# Altium project 7z010.PrjPcb
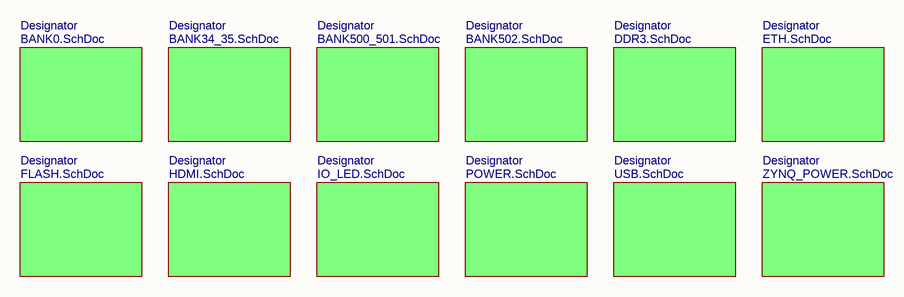
[diagram p0: TOP.SchDoc]
13 sheets, 293 parts. Net scope: global (net labels, ports and power ports of the same name join across sheets).
Board file: PCB1.PcbDoc
Sheets:
  TOP.SchDoc
    Designator = BANK0.SchDoc
    Designator = BANK34_35.SchDoc
    Designator = BANK500_501.SchDoc
    Designator = BANK502.SchDoc
    Designator = DDR3.SchDoc
    Designator = ETH.SchDoc
    Designator = FLASH.SchDoc
    Designator = HDMI.SchDoc
    Designator = IO_LED.SchDoc
    Designator = POWER.SchDoc
    Designator = USB.SchDoc
    Designator = ZYNQ_POWER.SchDoc

## Sheet TOP.SchDoc
size A4; SheetNumber: 1; SheetTotal: 13

### Sub-sheets
Designator = BANK0.SchDoc: no entries
Designator = BANK34_35.SchDoc: no entries
Designator = BANK500_501.SchDoc: no entries
Designator = BANK502.SchDoc: no entries
Designator = DDR3.SchDoc: no entries
Designator = ETH.SchDoc: no entries
Designator = FLASH.SchDoc: no entries
Designator = HDMI.SchDoc: no entries
Designator = IO_LED.SchDoc: no entries
Designator = POWER.SchDoc: no entries
Designator = USB.SchDoc: no entries
Designator = ZYNQ_POWER.SchDoc: no entries

## Sheet BANK0.SchDoc: BANK0
size A4; DrawnBy: nand; Revision: V0.1; SheetNumber: 3; SheetTotal: 13
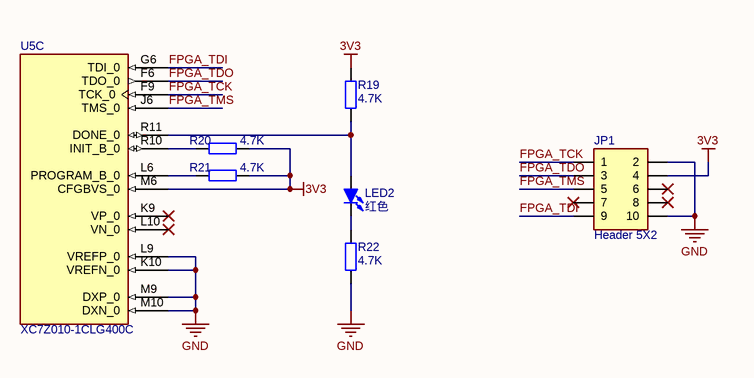
[diagram p1: BANK0.SchDoc]

### Parts
JP1  Header 5X2  [IDC2.54-LI-2x5P]
LED2  红色  [LED 0805G]
R19  4.7K  [R 0402_L]
R20  4.7K  [R 0402_L]
R21  4.7K  [R 0402_L]
R22  4.7K  [R 0402_L]
U5  XC7Z010-1CLG400C  [CLG400]  (part C of 9)

### Nets
3V3: JP1.4 R19.2 R20.1 R21.1 U5.M6(CFGBVS_0)
GND: JP1.2 JP1.10 R22.1 U5.K10(VREFN_0) U5.L9(VREFP_0) U5.M9(DXP_0) U5.M10(DXN_0)
FPGA_TCK: JP1.1 U5.F9(TCK_0)
FPGA_TDI: JP1.9 U5.G6(TDI_0)
FPGA_TDO: JP1.3 U5.F6(TDO_0)
FPGA_TMS: JP1.5 U5.J6(TMS_0)
NetLED2_1: LED2.1(A) R19.1 U5.R11(DONE_0)
NetLED2_2: LED2.2(K) R22.2
NetR20_2: R20.2 U5.R10(INIT_B_0)
NetR21_2: R21.2 U5.L6(PROGRAM_B_0)

Not connected (* = marked no-connect by the designer): JP1 6* 7* 8*; U5 K9(VP_0)* L10(VN_0)*

### Library data of the parts
JP1 = Header 5X2: 5*2P接插件; 版权归属: 源创客; BOM名称: 5*2P接插件; 学习资源: www.ooocke.com
LED2 = LED-SMD: 贴片LED; 版权归属: 源创客; BOM名称: 贴片LED; 学习资源: www.ooocke.com
R19-R22 = R: 贴片电阻; 版权归属: 源创客; BOM名称: 贴片电阻; 学习资源: www.ooocke.com
U5 = XC7Z010-1CLG400C: ZYNQ7000芯片

## Sheet BANK34_35.SchDoc
size A4; SheetNumber: 4; SheetTotal: 13
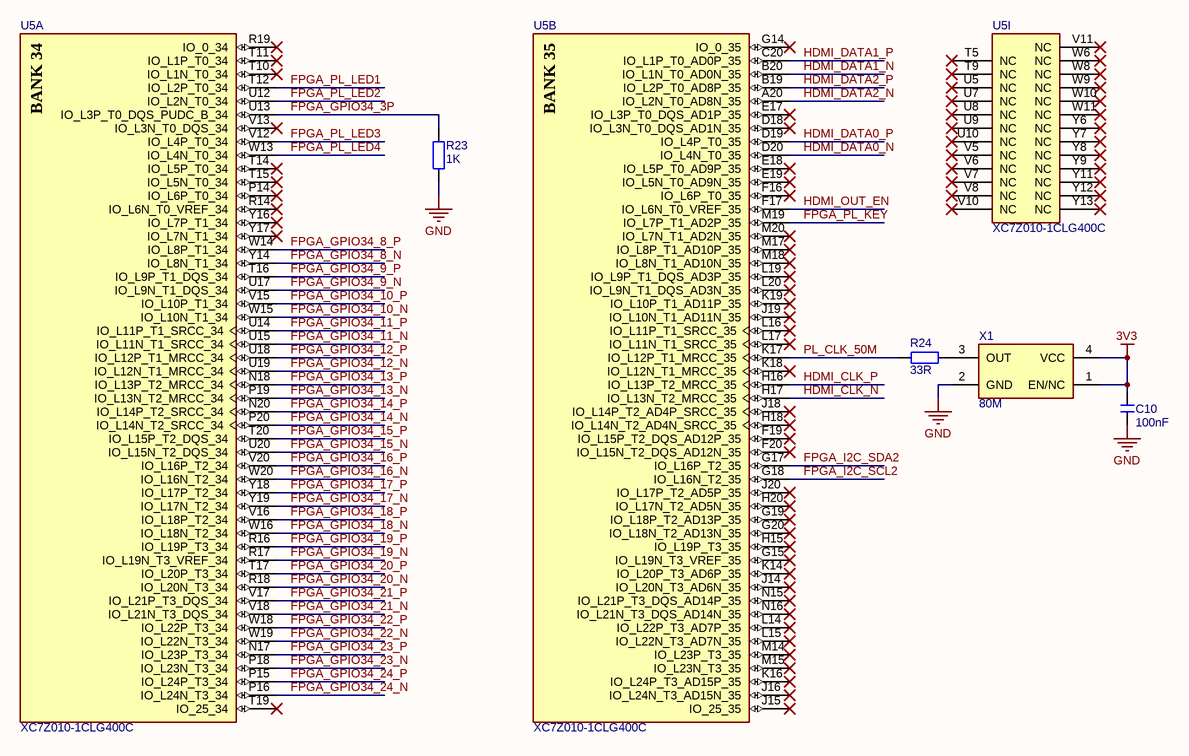
[diagram p2: BANK34_35.SchDoc]

### Parts
C10  100nF  [C 0402_L]
R23  1K  [R 0402_L]
R24  33R  [R 0805_L]
U5  XC7Z010-1CLG400C  [CLG400]  (parts A,B,I of 9)
X1  80M  [OSC 1612-4P]

### Nets
3V3: C10.2 X1.1(EN/NC) X1.4(VCC)
GND: C10.1 R23.2 X1.2(GND)
FPGA_GPIO34_3P: R23.1 U5.U13(IO_L3P_T0_DQS_PUDC_B_34)
FPGA_GPIO34_8_N: U5.Y14(IO_L8N_T1_34)
FPGA_GPIO34_8_P: U5.W14(IO_L8P_T1_34)
FPGA_GPIO34_9_N: U5.U17(IO_L9N_T1_DQS_34)
FPGA_GPIO34_9_P: U5.T16(IO_L9P_T1_DQS_34)
FPGA_GPIO34_10_N: U5.W15(IO_L10N_T1_34)
FPGA_GPIO34_10_P: U5.V15(IO_L10P_T1_34)
FPGA_GPIO34_11_N: U5.U15(IO_L11N_T1_SRCC_34)
FPGA_GPIO34_11_P: U5.U14(IO_L11P_T1_SRCC_34)
FPGA_GPIO34_12_N: U5.U19(IO_L12N_T1_MRCC_34)
FPGA_GPIO34_12_P: U5.U18(IO_L12P_T1_MRCC_34)
FPGA_GPIO34_13_N: U5.P19(IO_L13N_T2_MRCC_34)
FPGA_GPIO34_13_P: U5.N18(IO_L13P_T2_MRCC_34)
FPGA_GPIO34_14_N: U5.P20(IO_L14N_T2_SRCC_34)
FPGA_GPIO34_14_P: U5.N20(IO_L14P_T2_SRCC_34)
FPGA_GPIO34_15_N: U5.U20(IO_L15N_T2_DQS_34)
FPGA_GPIO34_15_P: U5.T20(IO_L15P_T2_DQS_34)
FPGA_GPIO34_16_N: U5.W20(IO_L16N_T2_34)
FPGA_GPIO34_16_P: U5.V20(IO_L16P_T2_34)
FPGA_GPIO34_17_N: U5.Y19(IO_L17N_T2_34)
FPGA_GPIO34_17_P: U5.Y18(IO_L17P_T2_34)
FPGA_GPIO34_18_N: U5.W16(IO_L18N_T2_34)
FPGA_GPIO34_18_P: U5.V16(IO_L18P_T2_34)
FPGA_GPIO34_19_N: U5.R17(IO_L19N_T3_VREF_34)
FPGA_GPIO34_19_P: U5.R16(IO_L19P_T3_34)
FPGA_GPIO34_20_N: U5.R18(IO_L20N_T3_34)
FPGA_GPIO34_20_P: U5.T17(IO_L20P_T3_34)
FPGA_GPIO34_21_N: U5.V18(IO_L21N_T3_DQS_34)
FPGA_GPIO34_21_P: U5.V17(IO_L21P_T3_DQS_34)
FPGA_GPIO34_22_N: U5.W19(IO_L22N_T3_34)
FPGA_GPIO34_22_P: U5.W18(IO_L22P_T3_34)
FPGA_GPIO34_23_N: U5.P18(IO_L23N_T3_34)
FPGA_GPIO34_23_P: U5.N17(IO_L23P_T3_34)
FPGA_GPIO34_24_N: U5.P16(IO_L24N_T3_34)
FPGA_GPIO34_24_P: U5.P15(IO_L24P_T3_34)
FPGA_I2C_SCL2: U5.G18(IO_L16N_T2_35)
FPGA_I2C_SDA2: U5.G17(IO_L16P_T2_35)
FPGA_PL_KEY: U5.M19(IO_L7P_T1_AD2P_35)
FPGA_PL_LED1: U5.T12(IO_L2P_T0_34)
FPGA_PL_LED2: U5.U12(IO_L2N_T0_34)
FPGA_PL_LED3: U5.V12(IO_L4P_T0_34)
FPGA_PL_LED4: U5.W13(IO_L4N_T0_34)
HDMI_CLK_N: U5.H17(IO_L13N_T2_MRCC_35)
HDMI_CLK_P: U5.H16(IO_L13P_T2_MRCC_35)
HDMI_DATA0_N: U5.D20(IO_L4N_T0_35)
HDMI_DATA0_P: U5.D19(IO_L4P_T0_35)
HDMI_DATA1_N: U5.B20(IO_L1N_T0_AD0N_35)
HDMI_DATA1_P: U5.C20(IO_L1P_T0_AD0P_35)
HDMI_DATA2_N: U5.A20(IO_L2N_T0_AD8N_35)
HDMI_DATA2_P: U5.B19(IO_L2P_T0_AD8P_35)
HDMI_OUT_EN: U5.F17(IO_L6N_T0_VREF_35)
PL_CLK_50M: R24.2 U5.K17(IO_L12P_T1_MRCC_35)
NetR24_1: R24.1 X1.3(OUT)

Not connected (* = marked no-connect by the designer): U5 D18(IO_L3N_T0_DQS_AD1N_35)* E17(IO_L3P_T0_DQS_AD1P_35)* E18(IO_L5P_T0_AD9P_35)* E19(IO_L5N_T0_AD9N_35)* F16(IO_L6P_T0_35)* F19(IO_L15P_T2_DQS_AD12P_35)* F20(IO_L15N_T2_DQS_AD12N_35)* G14(IO_0_35)* G15(IO_L19N_T3_VREF_35)* G19(IO_L18P_T2_AD13P_35)* G20(IO_L18N_T2_AD13N_35)* H15(IO_L19P_T3_35)* H18(IO_L14N_T2_AD4N_SRCC_35)* H20(IO_L17N_T2_AD5N_35)* J14(IO_L20N_T3_AD6N_35)* J15(IO_25_35)* J16(IO_L24N_T3_AD15N_35)* J18(IO_L14P_T2_AD4P_SRCC_35)* J19(IO_L10N_T1_AD11N_35)* J20(IO_L17P_T2_AD5P_35)* K14(IO_L20P_T3_AD6P_35)* K16(IO_L24P_T3_AD15P_35)* K18(IO_L12N_T1_MRCC_35)* K19(IO_L10P_T1_AD11P_35)* L14(IO_L22P_T3_AD7P_35)* L15(IO_L22N_T3_AD7N_35)* L16(IO_L11P_T1_SRCC_35)* L17(IO_L11N_T1_SRCC_35)* L19(IO_L9P_T1_DQS_AD3P_35)* L20(IO_L9N_T1_DQS_AD3N_35)* M14(IO_L23P_T3_35)* M15(IO_L23N_T3_35)* M17(IO_L8P_T1_AD10P_35)* M18(IO_L8N_T1_AD10N_35)* M20(IO_L7N_T1_AD2N_35)* N15(IO_L21P_T3_DQS_AD14P_35)* N16(IO_L21N_T3_DQS_AD14N_35)* P14(IO_L6P_T0_34)* R14(IO_L6N_T0_VREF_34)* R19(IO_0_34)* T5(NC)* T9(NC)* T10(IO_L1N_T0_34)* T11(IO_L1P_T0_34)* T14(IO_L5P_T0_34)* T15(IO_L5N_T0_34)* T19(IO_25_34)* U5(NC)* U7(NC)* U8(NC)* U9(NC)* U10(NC)* V5(NC)* V6(NC)* V7(NC)* V8(NC)* V10(NC)* V11(NC)* V13(IO_L3N_T0_DQS_34)* W6(NC)* W8(NC)* W9(NC)* W10(NC)* W11(NC)* Y6(NC)* Y7(NC)* Y8(NC)* Y9(NC)* Y11(NC)* Y12(NC)* Y13(NC)* Y16(IO_L7P_T1_34)* Y17(IO_L7N_T1_34)*

### Notes on the sheet
- (in symbol XC7Z010-1CLG400C, part A) BANK 34
- (in symbol XC7Z010-1CLG400C, part B) BANK 35

### Library data of the parts
C10 = C: 无极性贴片电容; 版权归属: 源创客; BOM名称: 无极性贴片电容; 学习资源: www.ooocke.com
R23 R24 = R: 贴片电阻; 版权归属: 源创客; BOM名称: 贴片电阻; 学习资源: www.ooocke.com
U5 = XC7Z010-1CLG400C: ZYNQ7000芯片
X1 = XTAL-ACT-4P: 4脚有源晶振; 版权归属: 源创客; BOM名称: 4脚有源晶振; 学习资源: www.ooocke.com

## Sheet BANK500_501.SchDoc
size A4; SheetNumber: 5; SheetTotal: 13
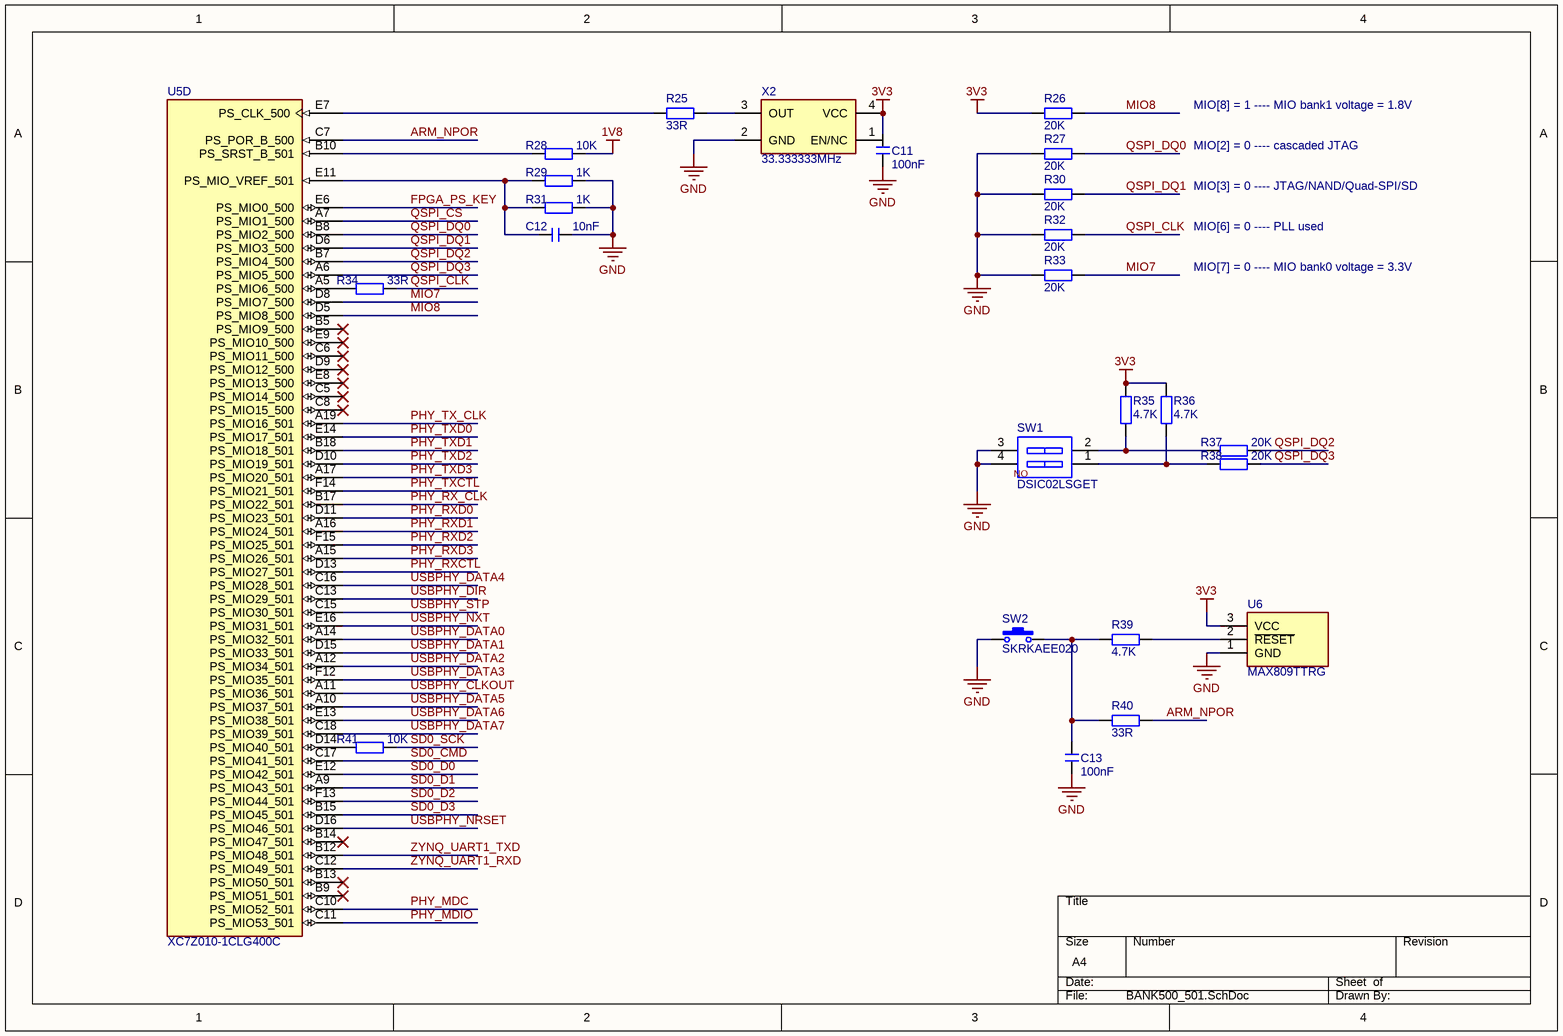
[diagram p3: BANK500_501.SchDoc]

### Parts
C11  100nF  [C 0402_L]
C12  10nF  [C 0402_L]
C13  100nF  [C 0402_L]
R25  33R  [R 0805_L]
R26  20K  [R 0805_L]
R27  20K  [R 0805_L]
R28  10K  [R 0402_L]
R29  1K  [R 0402_L]
R30  20K  [R 0805_L]
R31  1K  [R 0402_L]
R32  20K  [R 0805_L]
R33  20K  [R 0805_L]
R34  33R  [R 0805_L]
R35  4.7K  [R 0402_L]
R36  4.7K  [R 0402_L]
R37  20K  [R 0805_L]
R38  20K  [R 0805_L]
R39  4.7K  [R 0402_L]
R40  33R  [R 0805_L]
R41  10K  [R 0402_L]
SW1  DSIC02LSGET  [SOP254P930X445-4N]
SW2  SKRKAEE020  [SKRKAEE020]
U5  XC7Z010-1CLG400C  [CLG400]  (part D of 9)
U6  MAX809TTRG  [SOT23-3L]
X2  33.333333MHz  [OSC 1612-4P]

### Nets
1V8: R28.1
3V3: C11.2 R26.2 R35.1 R36.1 U6.3(VCC) X2.4(VCC)
GND: C11.1 C12.1 C13.1 R27.2 R29.1 R30.2 R31.1 R32.2 R33.2 SW1.3 SW1.4 SW2.1 U6.1(GND) X2.2(GND)
ARM_NPOR: R40.1 U5.C7(PS_POR_B_500)
FPGA_PS_KEY: U5.E6(PS_MIO0_500)
MIO7: R33.1 U5.D8(PS_MIO7_500)
MIO8: R26.1 U5.D5(PS_MIO8_500)
PHY_MDC: U5.C10(PS_MIO52_501)
PHY_MDIO: U5.C11(PS_MIO53_501)
PHY_RX_CLK: U5.B17(PS_MIO22_501)
PHY_RXCTL: U5.D13(PS_MIO27_501)
PHY_RXD0: U5.D11(PS_MIO23_501)
PHY_RXD1: U5.A16(PS_MIO24_501)
PHY_RXD2: U5.F15(PS_MIO25_501)
PHY_RXD3: U5.A15(PS_MIO26_501)
PHY_TX_CLK: U5.A19(PS_MIO16_501)
PHY_TXCTL: U5.F14(PS_MIO21_501)
PHY_TXD0: U5.E14(PS_MIO17_501)
PHY_TXD1: U5.B18(PS_MIO18_501)
PHY_TXD2: U5.D10(PS_MIO19_501)
PHY_TXD3: U5.A17(PS_MIO20_501)
QSPI_CLK: R32.1 R34.1
QSPI_CS: U5.A7(PS_MIO1_500)
QSPI_DQ0: R27.1 U5.B8(PS_MIO2_500)
QSPI_DQ1: R30.1 U5.D6(PS_MIO3_500)
QSPI_DQ2: R37.1 U5.B7(PS_MIO4_500)
QSPI_DQ3: R38.1 U5.A6(PS_MIO5_500)
SD0_CMD: U5.C17(PS_MIO41_501)
SD0_D0: U5.E12(PS_MIO42_501)
SD0_D1: U5.A9(PS_MIO43_501)
SD0_D2: U5.F13(PS_MIO44_501)
SD0_D3: U5.B15(PS_MIO45_501)
SD0_SCK: R41.1
USBPHY_CLKOUT: U5.A11(PS_MIO36_501)
USBPHY_DATA0: U5.A14(PS_MIO32_501)
USBPHY_DATA1: U5.D15(PS_MIO33_501)
USBPHY_DATA2: U5.A12(PS_MIO34_501)
USBPHY_DATA3: U5.F12(PS_MIO35_501)
USBPHY_DATA4: U5.C16(PS_MIO28_501)
USBPHY_DATA5: U5.A10(PS_MIO37_501)
USBPHY_DATA6: U5.E13(PS_MIO38_501)
USBPHY_DATA7: U5.C18(PS_MIO39_501)
USBPHY_DIR: U5.C13(PS_MIO29_501)
USBPHY_NRSET: U5.D16(PS_MIO46_501)
USBPHY_NXT: U5.E16(PS_MIO31_501)
USBPHY_STP: U5.C15(PS_MIO30_501)
ZYNQ_UART1_RXD: U5.C12(PS_MIO49_501)
ZYNQ_UART1_TXD: U5.B12(PS_MIO48_501)
NetC12_2: C12.2 R29.2 R31.2 U5.E11(PS_MIO_VREF_501)
NetC13_2: C13.2 R39.2 R40.2 SW2.2
NetR25_1: R25.1 X2.3(OUT)
NetR25_2: R25.2 U5.E7(PS_CLK_500)
NetR28_2: R28.2 U5.B10(PS_SRST_B_501)
NetR34_2: R34.2 U5.A5(PS_MIO6_500)
NetR35_2: R35.2 R37.2 SW1.2
NetR36_2: R36.2 R38.2 SW1.1
NetR39_1: R39.1 U6.2(~{RESET})
NetR41_2: R41.2 U5.D14(PS_MIO40_501)

Not connected (* = marked no-connect by the designer): U5 B5(PS_MIO9_500)* B9(PS_MIO51_501)* B13(PS_MIO50_501)* B14(PS_MIO47_501)* C5(PS_MIO14_500)* C6(PS_MIO11_500)* C8(PS_MIO15_500)* D9(PS_MIO12_500)* E8(PS_MIO13_500)* E9(PS_MIO10_500)*; X2 1(EN/NC)

### Notes on the sheet
- MIO[8] = 1 ---- MIO bank1 voltage = 1.8V
- MIO[2] = 0 ---- cascaded JTAG
- MIO[3] = 0 ---- JTAG/NAND/Quad-SPI/SD
- MIO[6] = 0 ---- PLL used
- MIO[7] = 0 ---- MIO bank0 voltage = 3.3V
- (in symbol DSIC02LSGET) ON

### Library data of the parts
C11-C13 = C: 无极性贴片电容; 版权归属: 源创客; BOM名称: 无极性贴片电容; 学习资源: www.ooocke.com
R25-R41 = R: 贴片电阻; 版权归属: 源创客; BOM名称: 贴片电阻; 学习资源: www.ooocke.com
SW1 = DSIC02LSGET: 2路拨动开关; Manufacturer_Name: Dongguan Guangzhu Industrial; Datasheet Link: https://datasheet.lcsc.com/szlcsc/Dongguan-Guangzhu-Industrial-DSIC02LSGET_C54949.pdf; Height: 4.45mm; Manufacturer_Part_Number: DSIC02LSGET
SW2 = SKRKAEE020: 2.9x3.9轻触开关; BOM名称: 3x6轻触开关; 联系卖家，免费查找封装: 唯一出售店铺网址https://shop463601444.taobao.com; 封装库来自淘宝卖家ID：黄晶宝石: 其他店铺购入的，请立即申请退款，本店现金奖励20~500元
U5 = XC7Z010-1CLG400C: ZYNQ7000芯片
U6 = MAX809TTRG: 电压检测复位芯片; Manufacturer_Name: onsemi; Datasheet Link: http://www.onsemi.com/pub/Collateral/MAX809S-D.PDF; Height: 1.11mm; Manufacturer_Part_Number: MAX809TTRG; Mouser Part Number: 863-MAX809TTRG; Mouser Price/Stock: https://www.mouser.com/Search/Refine.aspx?Keyword=863-MAX809TTRG; Arrow Part Number: MAX809TTRG; Arrow Price/Stock: https://www.arrow.com/en/products/max809ttrg/on-semiconductor
X2 = XTAL-ACT-4P: 4脚有源晶振; 版权归属: 源创客; BOM名称: 4脚有源晶振; 学习资源: www.ooocke.com

## Sheet BANK502.SchDoc
size A4; SheetNumber: 6; SheetTotal: 13
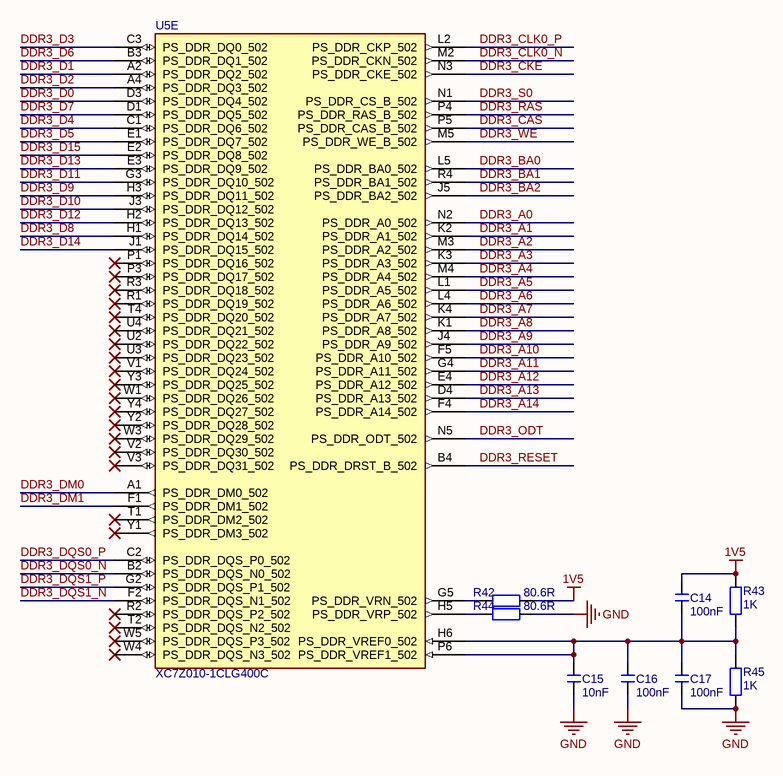
[diagram p4: BANK502.SchDoc]

### Parts
C14  100nF  [C 0402_L]
C15  10nF  [C 0402_L]
C16  100nF  [C 0402_L]
C17  100nF  [C 0402_L]
R42  80.6R  [R 0805_L]
R43  1K  [R 0402_L]
R44  80.6R  [R 0805_L]
R45  1K  [R 0402_L]
U5  XC7Z010-1CLG400C  [CLG400]  (part E of 9)

### Nets
1V5: C14.2 R42.2 R43.1
GND: C15.1 C16.1 C17.1 R44.2 R45.2
DDR3_A0: U5.N2(PS_DDR_A0_502)
DDR3_A1: U5.K2(PS_DDR_A1_502)
DDR3_A2: U5.M3(PS_DDR_A2_502)
DDR3_A3: U5.K3(PS_DDR_A3_502)
DDR3_A4: U5.M4(PS_DDR_A4_502)
DDR3_A5: U5.L1(PS_DDR_A5_502)
DDR3_A6: U5.L4(PS_DDR_A6_502)
DDR3_A7: U5.K4(PS_DDR_A7_502)
DDR3_A8: U5.K1(PS_DDR_A8_502)
DDR3_A9: U5.J4(PS_DDR_A9_502)
DDR3_A10: U5.F5(PS_DDR_A10_502)
DDR3_A11: U5.G4(PS_DDR_A11_502)
DDR3_A12: U5.E4(PS_DDR_A12_502)
DDR3_A13: U5.D4(PS_DDR_A13_502)
DDR3_A14: U5.F4(PS_DDR_A14_502)
DDR3_BA0: U5.L5(PS_DDR_BA0_502)
DDR3_BA1: U5.R4(PS_DDR_BA1_502)
DDR3_BA2: U5.J5(PS_DDR_BA2_502)
DDR3_CAS: U5.P5(PS_DDR_CAS_B_502)
DDR3_CKE: U5.N3(PS_DDR_CKE_502)
DDR3_CLK0_N: U5.M2(PS_DDR_CKN_502)
DDR3_CLK0_P: U5.L2(PS_DDR_CKP_502)
DDR3_D0: U5.D3(PS_DDR_DQ4_502)
DDR3_D1: U5.A2(PS_DDR_DQ2_502)
DDR3_D2: U5.A4(PS_DDR_DQ3_502)
DDR3_D3: U5.C3(PS_DDR_DQ0_502)
DDR3_D4: U5.C1(PS_DDR_DQ6_502)
DDR3_D5: U5.E1(PS_DDR_DQ7_502)
DDR3_D6: U5.B3(PS_DDR_DQ1_502)
DDR3_D7: U5.D1(PS_DDR_DQ5_502)
DDR3_D8: U5.H1(PS_DDR_DQ14_502)
DDR3_D9: U5.H3(PS_DDR_DQ11_502)
DDR3_D10: U5.J3(PS_DDR_DQ12_502)
DDR3_D11: U5.G3(PS_DDR_DQ10_502)
DDR3_D12: U5.H2(PS_DDR_DQ13_502)
DDR3_D13: U5.E3(PS_DDR_DQ9_502)
DDR3_D14: U5.J1(PS_DDR_DQ15_502)
DDR3_D15: U5.E2(PS_DDR_DQ8_502)
DDR3_DM0: U5.A1(PS_DDR_DM0_502)
DDR3_DM1: U5.F1(PS_DDR_DM1_502)
DDR3_DQS0_N: U5.B2(PS_DDR_DQS_N0_502)
DDR3_DQS0_P: U5.C2(PS_DDR_DQS_P0_502)
DDR3_DQS1_N: U5.F2(PS_DDR_DQS_N1_502)
DDR3_DQS1_P: U5.G2(PS_DDR_DQS_P1_502)
DDR3_ODT: U5.N5(PS_DDR_ODT_502)
DDR3_RAS: U5.P4(PS_DDR_RAS_B_502)
DDR3_RESET: U5.B4(PS_DDR_DRST_B_502)
DDR3_S0: U5.N1(PS_DDR_CS_B_502)
DDR3_WE: U5.M5(PS_DDR_WE_B_502)
NetC14_1: C14.1 C15.2 C16.2 C17.2 R43.2 R45.1 U5.H6(PS_DDR_VREF0_502) U5.P6(PS_DDR_VREF1_502)
NetR42_1: R42.1 U5.G5(PS_DDR_VRN_502)
NetR44_1: R44.1 U5.H5(PS_DDR_VRP_502)

Not connected (* = marked no-connect by the designer): U5 P1(PS_DDR_DQ16_502)* P3(PS_DDR_DQ17_502)* R1(PS_DDR_DQ19_502)* R2(PS_DDR_DQS_P2_502)* R3(PS_DDR_DQ18_502)* T1(PS_DDR_DM2_502)* T2(PS_DDR_DQS_N2_502)* T4(PS_DDR_DQ20_502)* U2(PS_DDR_DQ22_502)* U3(PS_DDR_DQ23_502)* U4(PS_DDR_DQ21_502)* V1(PS_DDR_DQ24_502)* V2(PS_DDR_DQ30_502)* V3(PS_DDR_DQ31_502)* W1(PS_DDR_DQ26_502)* W3(PS_DDR_DQ29_502)* W4(PS_DDR_DQS_N3_502)* W5(PS_DDR_DQS_P3_502)* Y1(PS_DDR_DM3_502)* Y2(PS_DDR_DQ28_502)* Y3(PS_DDR_DQ25_502)* Y4(PS_DDR_DQ27_502)*

### Library data of the parts
C14-C17 = C: 无极性贴片电容; 版权归属: 源创客; BOM名称: 无极性贴片电容; 学习资源: www.ooocke.com
R42-R45 = R: 贴片电阻; 版权归属: 源创客; BOM名称: 贴片电阻; 学习资源: www.ooocke.com
U5 = XC7Z010-1CLG400C: ZYNQ7000芯片

## Sheet DDR3.SchDoc
size A4; SheetNumber: 8; SheetTotal: 13
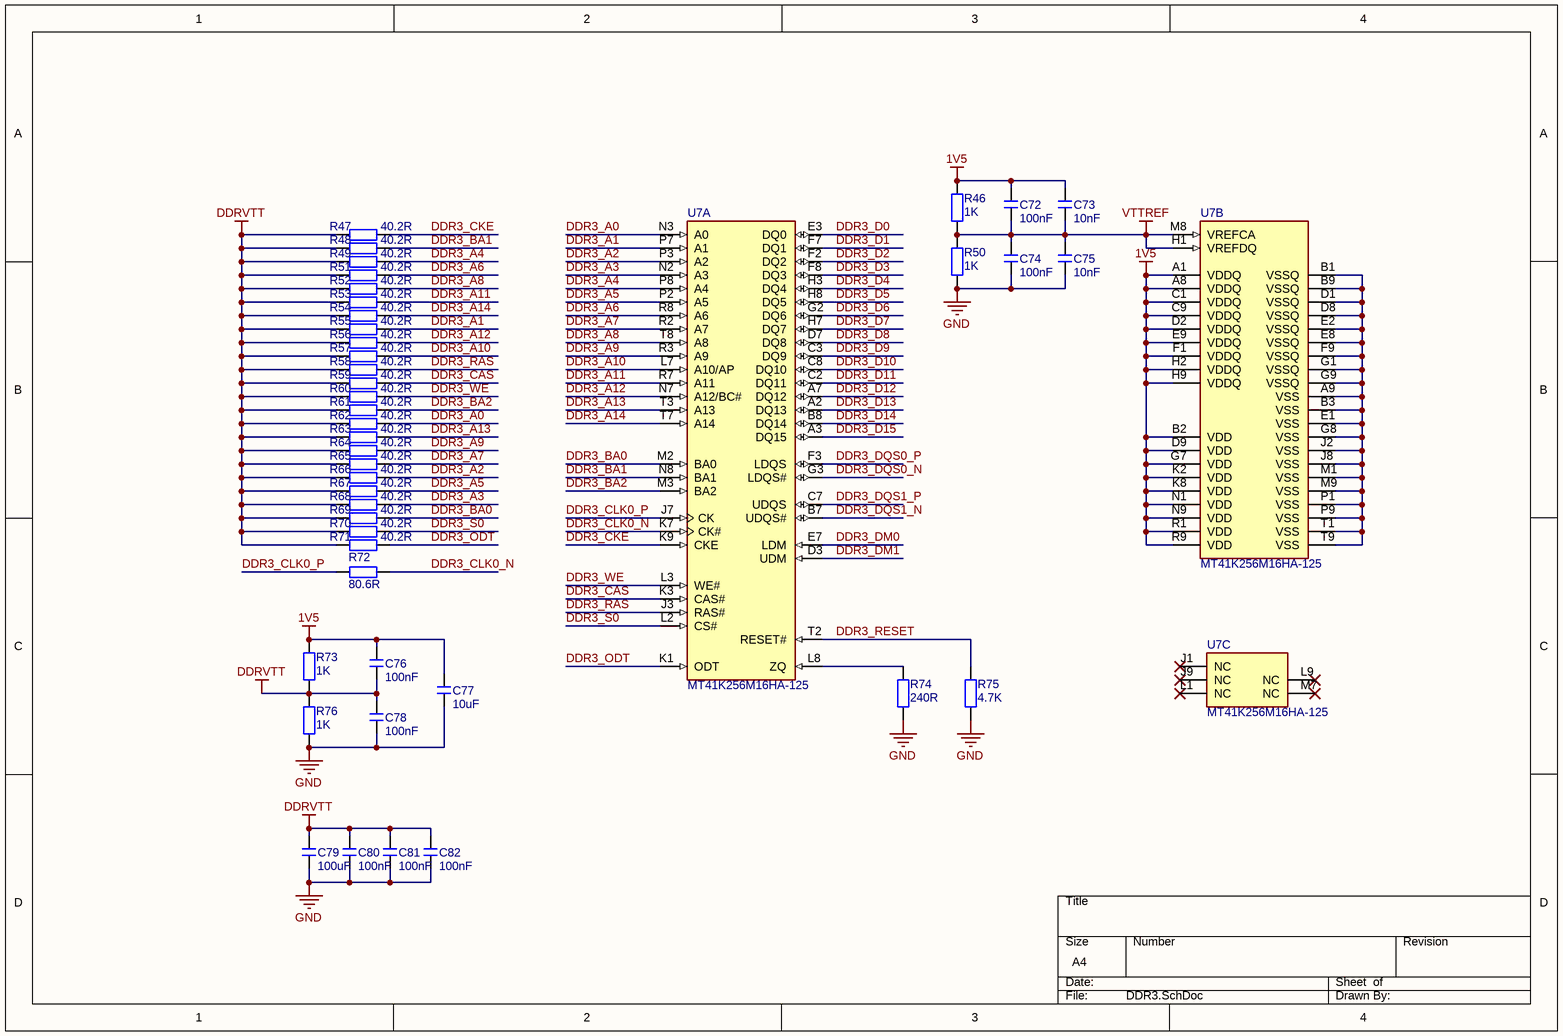
[diagram p5: DDR3.SchDoc]

### Parts
C72  100nF  [C 0402_L]
C73  10nF  [C 0402_L]
C74  100nF  [C 0402_L]
C75  10nF  [C 0402_L]
C76  100nF  [C 0402_L]
C77  10uF  [C 0603_L]
C78  100nF  [C 0402_L]
C79  100uF  [C 0805_L]
C80  100nF  [C 0402_L]
C81  100nF  [C 0402_L]
C82  100nF  [C 0402_L]
R46  1K  [R 0402_L]
R47  40.2R  [R 0805_L]
R48  40.2R  [R 0805_L]
R49  40.2R  [R 0805_L]
R50  1K  [R 0402_L]
R51  40.2R  [R 0805_L]
R52  40.2R  [R 0805_L]
R53  40.2R  [R 0805_L]
R54  40.2R  [R 0805_L]
R55  40.2R  [R 0805_L]
R56  40.2R  [R 0805_L]
R57  40.2R  [R 0805_L]
R58  40.2R  [R 0805_L]
R59  40.2R  [R 0805_L]
R60  40.2R  [R 0805_L]
R61  40.2R  [R 0805_L]
R62  40.2R  [R 0805_L]
R63  40.2R  [R 0805_L]
R64  40.2R  [R 0805_L]
R65  40.2R  [R 0805_L]
R66  40.2R  [R 0805_L]
R67  40.2R  [R 0805_L]
R68  40.2R  [R 0805_L]
R69  40.2R  [R 0805_L]
R70  40.2R  [R 0805_L]
R71  40.2R  [R 0805_L]
R72  80.6R  [R 0805_L]
R73  1K  [R 0402_L]
R74  240R  [R 0805_L]
R75  4.7K  [R 0402_L]
R76  1K  [R 0402_L]
U7  MT41K256M16HA-125  [BGA96C80P9X16_800X1300X120]  (parts A,B,C of 3)

### Nets
1V5: C72.2 C73.2 C76.2 C77.2 R46.2 R73.1 U7.A1(VDDQ) U7.A8(VDDQ) U7.B2(VDD) U7.C1(VDDQ) U7.C9(VDDQ) U7.D2(VDDQ) U7.D9(VDD) U7.E9(VDDQ) U7.F1(VDDQ) U7.G7(VDD) U7.H2(VDDQ) U7.H9(VDDQ) U7.K2(VDD) U7.K8(VDD) U7.N1(VDD) U7.N9(VDD) U7.R1(VDD) U7.R9(VDD)
DDRVTT: C76.1 C78.2 C79.2 C80.2 C81.2 C82.2 R47.2 R48.2 R49.2 R51.2 R52.2 R53.2 R54.2 R55.2 R56.2 R57.2 R58.2 R59.2 R60.2 R61.2 R62.2 R63.2 R64.2 R65.2 R66.2 R67.2 R68.2 R69.2 R70.2 R71.2 R73.2 R76.1
GND: C74.1 C75.1 C77.1 C78.1 C79.1 C80.1 C81.1 C82.1 R50.1 R74.2 R75.2 R76.2
VTTREF: C72.1 C73.1 C74.2 C75.2 R46.1 R50.2 U7.H1(VREFDQ) U7.M8(VREFCA)
DDR3_A0: R62.1 U7.N3(A0)
DDR3_A1: R55.1 U7.P7(A1)
DDR3_A2: R66.1 U7.P3(A2)
DDR3_A3: R68.1 U7.N2(A3)
DDR3_A4: R49.1 U7.P8(A4)
DDR3_A5: R67.1 U7.P2(A5)
DDR3_A6: R51.1 U7.R8(A6)
DDR3_A7: R65.1 U7.R2(A7)
DDR3_A8: R52.1 U7.T8(A8)
DDR3_A9: R64.1 U7.R3(A9)
DDR3_A10: R57.1 U7.L7(A10/AP)
DDR3_A11: R53.1 U7.R7(A11)
DDR3_A12: R56.1 U7.N7(A12/BC#)
DDR3_A13: R63.1 U7.T3(A13)
DDR3_A14: R54.1 U7.T7(A14)
DDR3_BA0: R69.1 U7.M2(BA0)
DDR3_BA1: R48.1 U7.N8(BA1)
DDR3_BA2: R61.1 U7.M3(BA2)
DDR3_CAS: R59.1 U7.K3(CAS#)
DDR3_CKE: R47.1 U7.K9(CKE)
DDR3_CLK0_N: R72.2 U7.K7(CK#)
DDR3_CLK0_P: R72.1 U7.J7(CK)
DDR3_D0: U7.E3(DQ0)
DDR3_D1: U7.F7(DQ1)
DDR3_D2: U7.F2(DQ2)
DDR3_D3: U7.F8(DQ3)
DDR3_D4: U7.H3(DQ4)
DDR3_D5: U7.H8(DQ5)
DDR3_D6: U7.G2(DQ6)
DDR3_D7: U7.H7(DQ7)
DDR3_D8: U7.D7(DQ8)
DDR3_D9: U7.C3(DQ9)
DDR3_D10: U7.C8(DQ10)
DDR3_D11: U7.C2(DQ11)
DDR3_D12: U7.A7(DQ12)
DDR3_D13: U7.A2(DQ13)
DDR3_D14: U7.B8(DQ14)
DDR3_D15: U7.A3(DQ15)
DDR3_DM0: U7.E7(LDM)
DDR3_DM1: U7.D3(UDM)
DDR3_DQS0_N: U7.G3(LDQS#)
DDR3_DQS0_P: U7.F3(LDQS)
DDR3_DQS1_N: U7.B7(UDQS#)
DDR3_DQS1_P: U7.C7(UDQS)
DDR3_ODT: R71.1 U7.K1(ODT)
DDR3_RAS: R58.1 U7.J3(RAS#)
DDR3_RESET: R75.1 U7.T2(RESET#)
DDR3_S0: R70.1 U7.L2(CS#)
DDR3_WE: R60.1 U7.L3(WE#)
NetR74_1: R74.1 U7.L8(ZQ)
NetU7_A9: U7.A9(VSS) U7.B1(VSSQ) U7.B3(VSS) U7.B9(VSSQ) U7.D1(VSSQ) U7.D8(VSSQ) U7.E1(VSS) U7.E2(VSSQ) U7.E8(VSSQ) U7.F9(VSSQ) U7.G1(VSSQ) U7.G8(VSS) U7.G9(VSSQ) U7.J2(VSS) U7.J8(VSS) U7.M1(VSS) U7.M9(VSS) U7.P1(VSS) U7.P9(VSS) U7.T1(VSS) U7.T9(VSS)

Not connected (* = marked no-connect by the designer): U7 J1(NC)* J9(NC)* L1(NC)* L9(NC)* M7(NC)*

### Library data of the parts
C72-C82 = C: 无极性贴片电容; 版权归属: 源创客; BOM名称: 无极性贴片电容; 学习资源: www.ooocke.com
R46-R76 = R: 贴片电阻; 版权归属: 源创客; BOM名称: 贴片电阻; 学习资源: www.ooocke.com
U7 = MT41K256M16HA-125: DDR3-16位数据-14位地址

## Sheet ETH.SchDoc
size A4; SheetNumber: 9; SheetTotal: 12
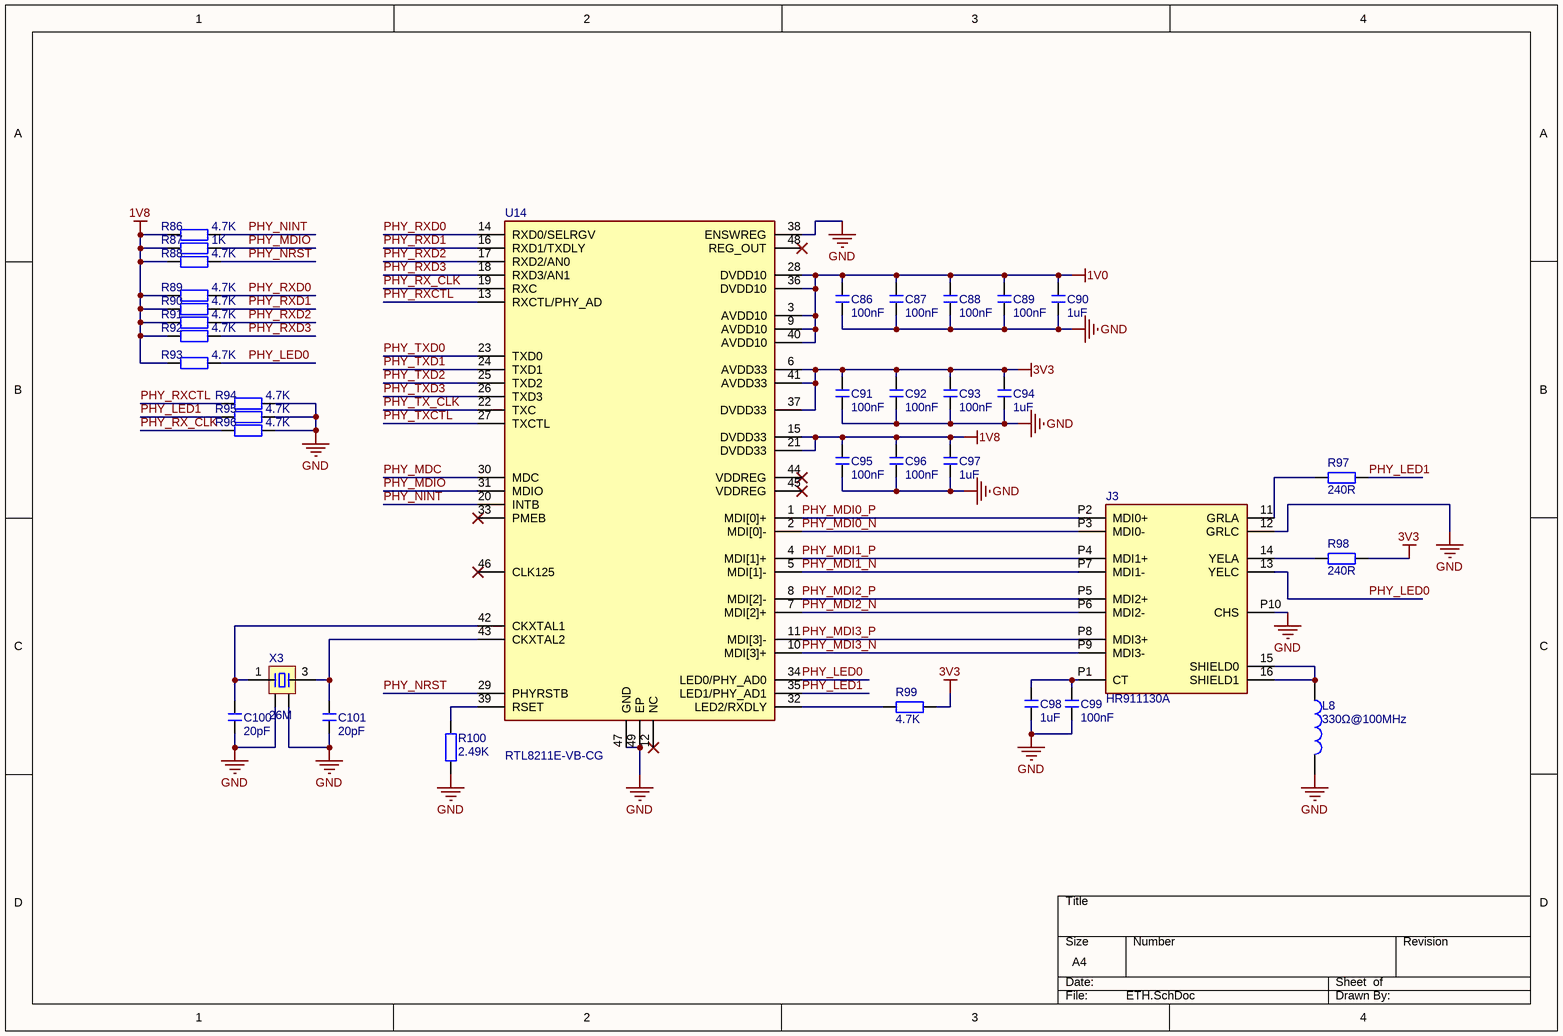
[diagram p6: ETH.SchDoc]

### Parts
C86  100nF  [C 0402_L]
C87  100nF  [C 0402_L]
C88  100nF  [C 0402_L]
C89  100nF  [C 0402_L]
C90  1uF  [C 0402_L]
C91  100nF  [C 0402_L]
C92  100nF  [C 0402_L]
C93  100nF  [C 0402_L]
C94  1uF  [C 0402_L]
C95  100nF  [C 0402_L]
C96  100nF  [C 0402_L]
C97  1uF  [C 0402_L]
C98  1uF  [C 0402_L]
C99  100nF  [C 0402_L]
C100  20pF  [C 0805_L]
C101  20pF  [C 0805_L]
J3  HR911130A  [HR911130A]
L8  330Ω@100MHz  [L 0805]
R86  4.7K  [R 0402_L]
R87  1K  [R 0402_L]
R88  4.7K  [R 0402_L]
R89  4.7K  [R 0402_L]
R90  4.7K  [R 0402_L]
R91  4.7K  [R 0402_L]
R92  4.7K  [R 0402_L]
R93  4.7K  [R 0402_L]
R94  4.7K  [R 0402_L]
R95  4.7K  [R 0402_L]
R96  4.7K  [R 0402_L]
R97  240R  [R 0805_L]
R98  240R  [R 0805_L]
R99  4.7K  [R 0402_L]
R100  2.49K  [R 0402_L]
U14  RTL8211E-VB-CG  [QFN48 7X7_L]
X3  26M  [OSC 1612-4P]

### Nets
1V0: C86.2 C87.2 C88.2 C89.2 C90.2 U14.3(AVDD10) U14.9(AVDD10) U14.28(DVDD10) U14.36(DVDD10) U14.40(AVDD10)
1V8: C95.2 C96.2 C97.2 R86.2 R87.2 R88.2 R89.2 R90.2 R91.2 R92.2 R93.2 U14.15(DVDD33) U14.21(DVDD33)
3V3: C91.2 C92.2 C93.2 C94.2 R98.1 R99.1 U14.6(AVDD33) U14.37(DVDD33) U14.41(AVDD33)
GND: C86.1 C87.1 C88.1 C89.1 C90.1 C91.1 C92.1 C93.1 C94.1 C95.1 C96.1 C97.1 C98.1 C99.1 C100.1 C101.1 J3.12(GRLC) J3.P10(CHS) L8.2 R94.1 R95.1 R96.1 R100.1 U14.38(ENSWREG) U14.47(GND) U14.49(EP) X3.2 X3.4
PHY_LED0: J3.13(YELC) R93.1 U14.34(LED0/PHY_AD0)
PHY_LED1: R95.2 R97.1 U14.35(LED1/PHY_AD1)
PHY_MDC: U14.30(MDC)
PHY_MDI0_N: J3.P3(MDI0-) U14.2(MDI[0]-)
PHY_MDI0_P: J3.P2(MDI0+) U14.1(MDI[0]+)
PHY_MDI1_N: J3.P7(MDI1-) U14.5(MDI[1]-)
PHY_MDI1_P: J3.P4(MDI1+) U14.4(MDI[1]+)
PHY_MDI2_N: J3.P6(MDI2-) U14.7(MDI[2]+)
PHY_MDI2_P: J3.P5(MDI2+) U14.8(MDI[2]-)
PHY_MDI3_N: J3.P9(MDI3-) U14.10(MDI[3]+)
PHY_MDI3_P: J3.P8(MDI3+) U14.11(MDI[3]-)
PHY_MDIO: R87.1 U14.31(MDIO)
PHY_NINT: R86.1 U14.20(INTB)
PHY_NRST: R88.1 U14.29(PHYRSTB)
PHY_RX_CLK: R96.2 U14.19(RXC)
PHY_RXCTL: R94.2 U14.13(RXCTL/PHY_AD)
PHY_RXD0: R89.1 U14.14(RXD0/SELRGV)
PHY_RXD1: R90.1 U14.16(RXD1/TXDLY)
PHY_RXD2: R91.1 U14.17(RXD2/AN0)
PHY_RXD3: R92.1 U14.18(RXD3/AN1)
PHY_TX_CLK: U14.22(TXC)
PHY_TXCTL: U14.27(TXCTL)
PHY_TXD0: U14.23(TXD0)
PHY_TXD1: U14.24(TXD1)
PHY_TXD2: U14.25(TXD2)
PHY_TXD3: U14.26(TXD3)
NetC98_2: C98.2 C99.2 J3.P1(CT)
NetC100_2: C100.2 U14.42(CKXTAL1) X3.1
NetC101_2: C101.2 U14.43(CKXTAL2) X3.3
NetJ3_11: J3.11(GRLA) R97.2
NetJ3_14: J3.14(YELA) R98.2
NetJ3_15: J3.15(SHIELD0) J3.16(SHIELD1) L8.1
NetR99_2: R99.2 U14.32(LED2/RXDLY)
NetR100_2: R100.2 U14.39(RSET)

Not connected (* = marked no-connect by the designer): U14 12(NC)* 33(PMEB)* 44(VDDREG)* 45(VDDREG)* 46(CLK125)* 48(REG_OUT)*

### Library data of the parts
C86-C101 = C: 无极性贴片电容; 版权归属: 源创客; BOM名称: 无极性贴片电容; 学习资源: www.ooocke.com
J3 = HR911130A: 千兆以太网带变压器; Manufacturer_Name: Hanrun Electronics; Datasheet Link: https://datasheet.lcsc.com/szlcsc/Zhongshan-HanRun-Elec-HR911130A_C54408.pdf; Height: 13mm; Manufacturer_Part_Number: HR911130A
L8 = L: 小功率贴片电感; 版权归属: 源创客; BOM名称: 小功率贴片电感; 学习资源: www.ooocke.com
R86-R100 = R: 贴片电阻; 版权归属: 源创客; BOM名称: 贴片电阻; 学习资源: www.ooocke.com
U14 = RTL8211E-VB-CG: 以太网芯片; Manufacturer_Name: Realtek; Datasheet Link: http://download3.dvd-driver.cz/realtek/datasheets/pdf/rtl8211e(g)-vb(vl)-cg_datasheet_1.6.pdf; Height: 1mm; Manufacturer_Part_Number: RTL8211E-VB-CG
X3 = XTAL-4P: 4脚无源晶振; 版权归属: 源创客; BOM名称: 4脚无源晶振; 学习资源: www.ooocke.com

## Sheet FLASH.SchDoc
size A4; SheetNumber: 9; SheetTotal: 13
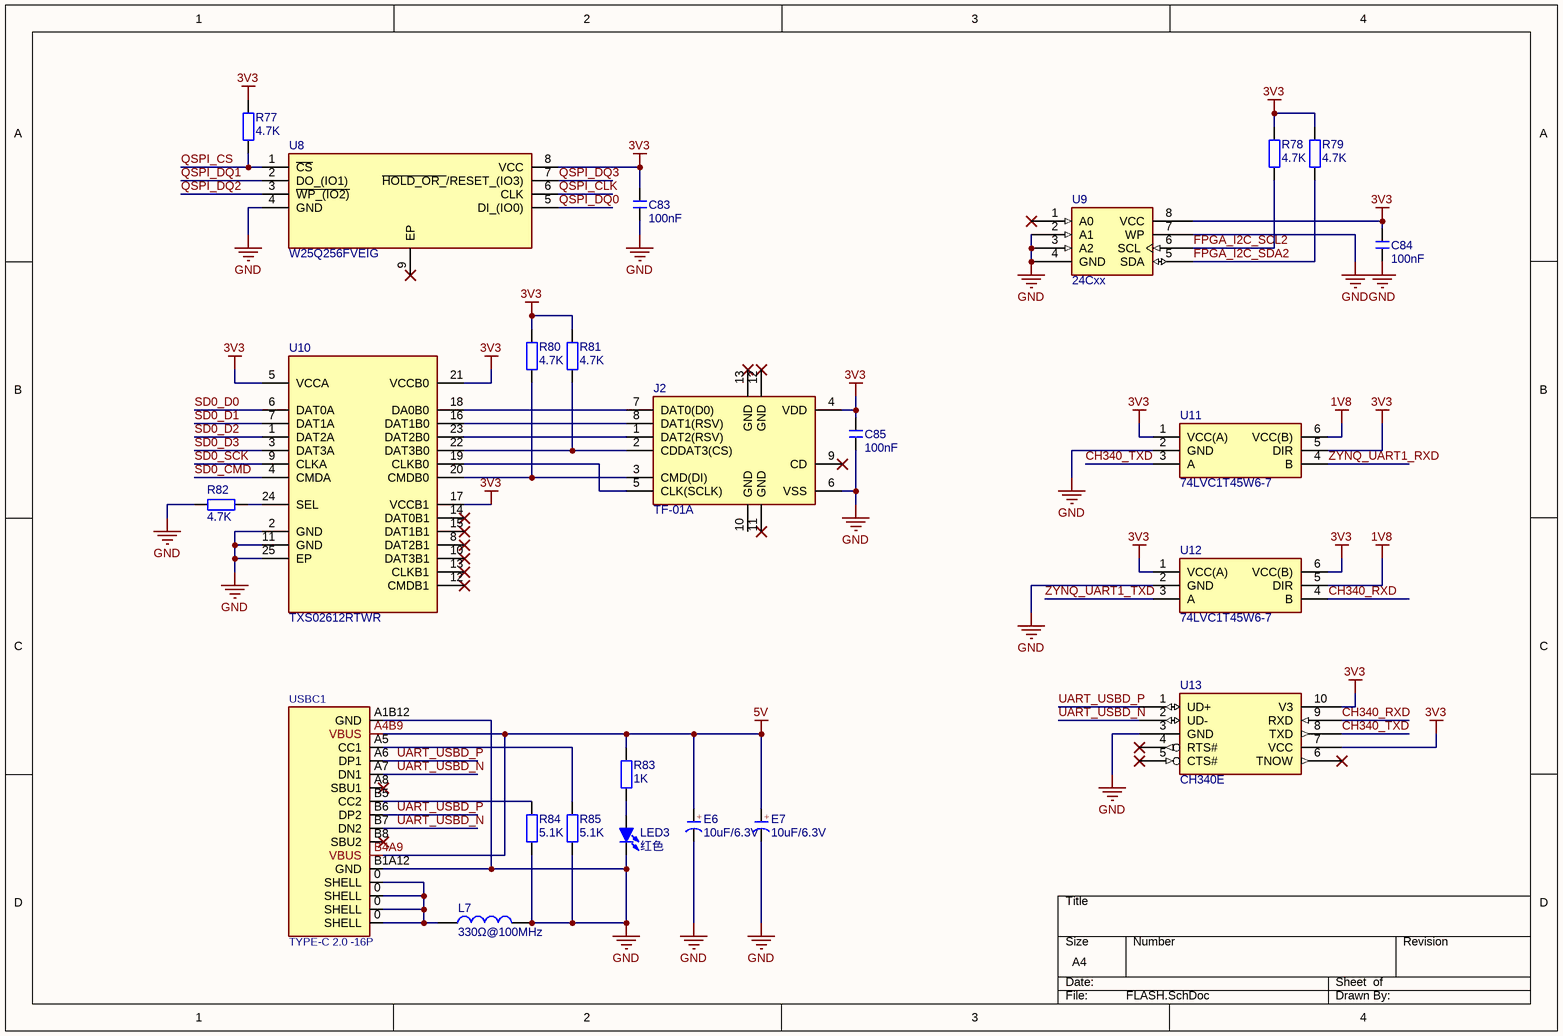
[diagram p7: FLASH.SchDoc]

### Parts
C83  100nF  [C 0402_L]
C84  100nF  [C 0402_L]
C85  100nF  [C 0402_L]
E6  10uF/6.3V  [CD A(3216)]
E7  10uF/6.3V  [CD A(3216)]
J2  TF-01A  [TF01A]
L7  330Ω@100MHz  [L 0805]
LED3  红色  [LED 0805G]
R77  4.7K  [R 0402_L]
R78  4.7K  [R 0402_L]
R79  4.7K  [R 0402_L]
R80  4.7K  [R 0402_L]
R81  4.7K  [R 0402_L]
R82  4.7K  [R 0402_L]
R83  1K  [R 0402_L]
R84  5.1K  [R 0402_L]
R85  5.1K  [R 0402_L]
U8  W25Q256FVEIG  [SON127P800X600X80-9N-D]
U9  24Cxx  [SOP8_L]
U10  TXS02612RTWR  [QFN24 4x4_L]
U11  74LVC1T45W6-7  [SOT23-6L]
U12  74LVC1T45W6-7  [SOT23-6L]
U13  CH340E  [MSOP10_L]
USBC1  TYPE-C 2.0 -16P  [USB-C-SMD_16P]

### Nets
1V8: U11.6(VCC(B)) U12.5(DIR)
3V3: C83.2 C84.2 C85.2 J2.4(VDD) R77.1 R78.1 R79.1 R80.1 R81.1 U8.8(VCC) U9.8(VCC) U10.5(VCCA) U10.17(VCCB1) U10.21(VCCB0) U11.1(VCC(A)) U11.5(DIR) U12.1(VCC(A)) U12.6(VCC(B)) U13.7(VCC) U13.10(V3)
5V: E6.1(A) E7.1(A) R83.2 USBC1.A4B9(VBUS) USBC1.B4A9(VBUS)
GND: C83.1 C84.1 C85.1 E6.2(K) E7.2(K) J2.6(VSS) L7.2 LED3.2(K) R82.1 R84.1 R85.1 U8.4(GND) U9.2(A1) U9.3(A2) U9.4(GND) U9.7(WP) U10.2(GND) U10.11(GND) U10.25(EP) U11.2(GND) U12.2(GND) U13.3(GND) USBC1.A1B12(GND) USBC1.B1A12(GND)
CH340_RXD: U12.4(B) U13.9(RXD)
CH340_TXD: U11.3(A) U13.8(TXD)
FPGA_I2C_SCL2: R78.2 U9.6(SCL)
FPGA_I2C_SDA2: R79.2 U9.5(SDA)
QSPI_CLK: U8.6(CLK)
QSPI_CS: R77.2 U8.1(~{CS})
QSPI_DQ0: U8.5(DI_(IO0))
QSPI_DQ1: U8.2(DO_(IO1))
QSPI_DQ2: U8.3(~{WP_(IO2)})
QSPI_DQ3: U8.7(~{HOLD_OR_}/RESET_(IO3))
SD0_CMD: U10.4(CMDA)
SD0_D0: U10.6(DAT0A)
SD0_D1: U10.7(DAT1A)
SD0_D2: U10.1(DAT2A)
SD0_D3: U10.3(DAT3A)
SD0_SCK: U10.9(CLKA)
UART_USBD_N: U13.2(UD-) USBC1.A7(DN1) USBC1.B7(DN2)
UART_USBD_P: U13.1(UD+) USBC1.A6(DP1) USBC1.B6(DP2)
ZYNQ_UART1_RXD: U11.4(B)
ZYNQ_UART1_TXD: U12.3(A)
NetJ2_1: J2.1(DAT2(RSV)) U10.23(DAT2B0)
NetJ2_2: J2.2(CDDAT3(CS)) R81.2 U10.22(DAT3B0)
NetJ2_3: J2.3(CMD(DI)) R80.2 U10.20(CMDB0)
NetJ2_5: J2.5(CLK(SCLK)) U10.19(CLKB0)
NetJ2_7: J2.7(DAT0(D0)) U10.18(DA0B0)
NetJ2_8: J2.8(DAT1(RSV)) U10.16(DAT1B0)
NetL7_1: L7.1 USBC1.0(SHELL)
NetLED3_1: LED3.1(A) R83.1
NetR82_2: R82.2 U10.24(SEL)
NetR84_2: R84.2 USBC1.B5(CC2)
NetR85_2: R85.2 USBC1.A5(CC1)

Not connected (* = marked no-connect by the designer): J2 9(CD)* 10(GND) 11(GND)* 12(GND)* 13(GND)*; U8 9(EP)*; U9 1(A0)*; U10 8(DAT2B1)* 10(DAT3B1)* 12(CMDB1)* 13(CLKB1)* 14(DAT0B1)* 15(DAT1B1)*; U13 4(RTS#)* 5(CTS#)* 6(TNOW)*; USBC1 A8(SBU1)* B8(SBU2)*

### Notes on the sheet
- (in symbol C-CD) +

### Library data of the parts
C83-C85 = C: 无极性贴片电容; 版权归属: 源创客; BOM名称: 无极性贴片电容; 学习资源: www.ooocke.com
E6 E7 = C-CD: 贴片钽电容; 版权归属: 源创客; BOM名称: 贴片钽电容; 学习资源: www.ooocke.com
J2 = TF-01A: TF卡座; Manufacturer_Name: Korean Hroparts Elec; Datasheet Link: https://datasheet.lcsc.com/szlcsc/1903221101_Korean-Hroparts-Elec-TF-01A_C91145.pdf; Height: 1.85mm; Manufacturer_Part_Number: TF-01A
L7 = L: 小功率贴片电感; 版权归属: 源创客; BOM名称: 小功率贴片电感; 学习资源: www.ooocke.com
LED3 = LED-SMD: 贴片LED; 版权归属: 源创客; BOM名称: 贴片LED; 学习资源: www.ooocke.com
R77-R85 = R: 贴片电阻; 版权归属: 源创客; BOM名称: 贴片电阻; 学习资源: www.ooocke.com
U8 = W25Q256FVEIG: 外置Flash; Manufacturer_Name: Winbond; Datasheet Link: https://www.winbond.com/resource-files/w25q256fv%20revi%2002262016%20kms.pdf; Height: 0.8mm; Manufacturer_Part_Number: W25Q256FVEIG; Mouser Part Number: N/A; Mouser Price/Stock: https://www.mouser.co.uk/ProductDetail/Winbond/W25Q256FVEIG?qs=rkhjVJ6%2F3ELJv0ZVUL2rAg%3D%3D; Arrow Part Number: W25Q256FVEIG; Arrow Price/Stock: https://www.arrow.com/en/products/w25q256fveig/winbond-electronics
U9 = 24Cxx: 外置EEPROM; 版权归属: 源创客; BOM名称: 外置EEPROM; 学习资源: www.ooocke.com
U10 = TXS02612RTWR: SD/TF卡芯片; Manufacturer_Name: Texas Instruments; Datasheet Link: http://www.ti.com/lit/gpn/txs02612; Height: 0.8mm; Manufacturer_Part_Number: TXS02612RTWR; Mouser Part Number: 595-TXS02612RTWR; Mouser Price/Stock: https://www.mouser.co.uk/ProductDetail/Texas-Instruments/TXS02612RTWR?qs=dqESbKqT1jaNFKC1R4M7hw%3D%3D; Arrow Part Number: TXS02612RTWR; Arrow Price/Stock: https://www.arrow.com/en/products/txs02612rtwr/texas-instruments?region=nac
U11 U12 = 74LVC1T45W6-7: 单向电平转换; Manufacturer_Name: Diodes Inc.; Datasheet Link: https://www.diodes.com/assets/Datasheets/74LVC1T45.pdf; Height: 1.4mm; Manufacturer_Part_Number: 74LVC1T45W6-7; Mouser Part Number: 621-74LVC1T45W6-7; Mouser Price/Stock: https://www.mouser.co.uk/ProductDetail/Diodes-Incorporated/74LVC1T45W6-7?qs=Oxncjon6mbp2oDYwZRj9AA%3D%3D; Arrow Part Number: 74LVC1T45W6-7; Arrow Price/Stock: https://www.arrow.com/en/products/74lvc1t45w6-7/diodes-incorporated?region=nac
U13 = CH340E: USB转串口; 联系卖家，免费技术支持: 唯一出售店铺网址https://shop463601444.taobao.com
USBC1 = USB2.0_Type-C_16Pin: USB2.0_Type-C_16Pin母座; 联系卖家 免费技术支持: 封装库来自淘宝卖家ID：黄晶宝石

## Sheet HDMI.SchDoc
size A4; SheetNumber: 11; SheetTotal: 13
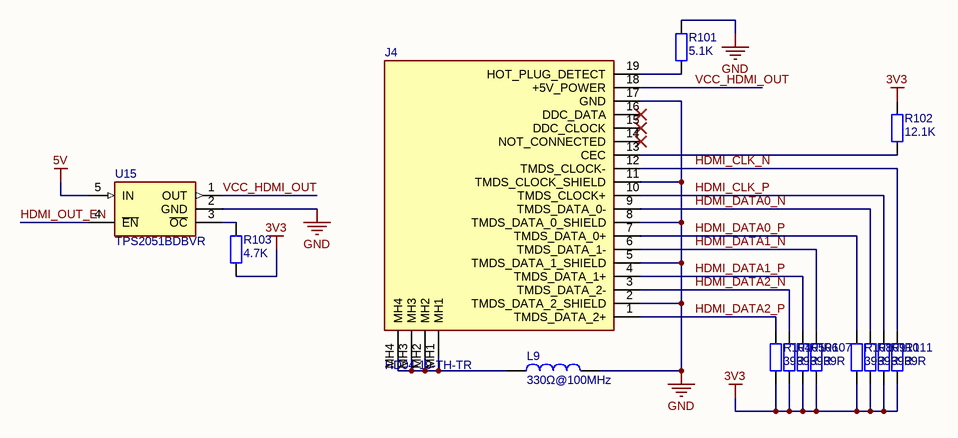
[diagram p8: HDMI.SchDoc]

### Parts
J4  HD04-19-TH-TR  [HD0419THTR]
L9  330Ω@100MHz  [L 0805]
R101  5.1K  [R 0402_L]
R102  12.1K  [R 0805_L]
R103  4.7K  [R 0402_L]
R104  39R  [R 0805_L]
R105  39R  [R 0805_L]
R106  39R  [R 0805_L]
R107  39R  [R 0805_L]
R108  39R  [R 0805_L]
R109  39R  [R 0805_L]
R110  39R  [R 0805_L]
R111  39R  [R 0805_L]
U15  TPS2051BDBVR  [SOT23-5N]

### Nets
3V3: R102.1 R103.1 R104.2 R105.2 R106.2 R107.2 R108.2 R109.2 R110.2 R111.2
5V: U15.5(IN)
GND: J4.2(TMDS_DATA_2_SHIELD) J4.5(TMDS_DATA_1_SHIELD) J4.8(TMDS_DATA_0_SHIELD) J4.11(TMDS_CLOCK_SHIELD) J4.17(GND) L9.2 R101.1 U15.2(GND)
HDMI_CLK_N: J4.12(TMDS_CLOCK-) R111.1
HDMI_CLK_P: J4.10(TMDS_CLOCK+) R110.1
HDMI_DATA0_N: J4.9(TMDS_DATA_0-) R109.1
HDMI_DATA0_P: J4.7(TMDS_DATA_0+) R108.1
HDMI_DATA1_N: J4.6(TMDS_DATA_1-) R107.1
HDMI_DATA1_P: J4.4(TMDS_DATA_1+) R106.1
HDMI_DATA2_N: J4.3(TMDS_DATA_2-) R105.1
HDMI_DATA2_P: J4.1(TMDS_DATA_2+) R104.1
HDMI_OUT_EN: U15.4(~{EN})
VCC_HDMI_OUT: J4.18(+5V_POWER) U15.1(OUT)
NetJ4_13: J4.13(CEC) R102.2
NetJ4_19: J4.19(HOT_PLUG_DETECT) R101.2
NetJ4_MH1: J4.MH1 J4.MH2 J4.MH3 J4.MH4 L9.1
NetR103_2: R103.2 U15.3(~{OC})

Not connected (* = marked no-connect by the designer): J4 14(NOT_CONNECTED)* 15(DDC_CLOCK)* 16(DDC_DATA)*

### Library data of the parts
J4 = HD04-19-TH-TR: HDMI接口; Manufacturer_Name: CUI Devices; Datasheet Link: https://www.cuidevices.com/product/resource/digikeypdf/hd04-19-th-tr.pdf; Height: 6.27mm; Manufacturer_Part_Number: HD04-19-TH-TR; Mouser Part Number: 179-HD04-19-TH-TR; Mouser Price/Stock: https://www.mouser.co.uk/ProductDetail/CUI-Devices/HD04-19-TH-TR?qs=A6eO%252BMLsxmSia1%252B4mHEhKQ%3D%3D
L9 = L: 小功率贴片电感; 版权归属: 源创客; BOM名称: 小功率贴片电感; 学习资源: www.ooocke.com
R101-R111 = R: 贴片电阻; 版权归属: 源创客; BOM名称: 贴片电阻; 学习资源: www.ooocke.com
U15 = TPS2051BDBVR: 模拟开关芯片; Manufacturer_Name: Texas Instruments; Datasheet Link: http://www.ti.com/lit/ds/symlink/tps2051b.pdf; Height: 1.45mm; Manufacturer_Part_Number: TPS2051BDBVR; Mouser Part Number: 595-TPS2051BDBVR; Mouser Price/Stock: https://www.mouser.co.uk/ProductDetail/Texas-Instruments/TPS2051BDBVR?qs=7kv20MEVUljVx%2Fqc0C%252Bidw%3D%3D; Arrow Part Number: TPS2051BDBVR; Arrow Price/Stock: https://www.arrow.com/en/products/tps2051bdbvr/texas-instruments?region=nac

## Sheet IO_LED.SchDoc
size A4; SheetNumber: 13; SheetTotal: 13
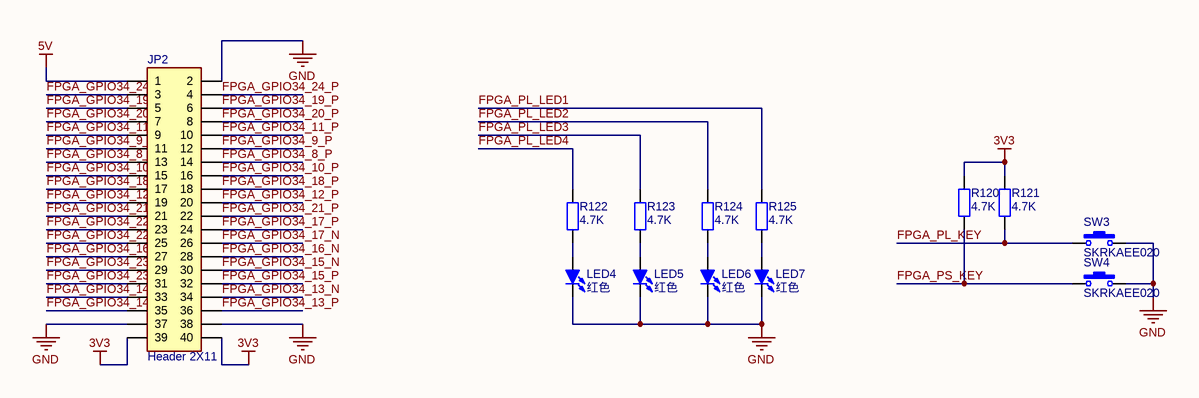
[diagram p9: IO_LED.SchDoc]

### Parts
JP2  Header 2X11  [IDC2.54-LI-2x20P]
LED4  红色  [LED 0805G]
LED5  红色  [LED 0805G]
LED6  红色  [LED 0805G]
LED7  红色  [LED 0805G]
R120  4.7K  [R 0402_L]
R121  4.7K  [R 0402_L]
R122  4.7K  [R 0402_L]
R123  4.7K  [R 0402_L]
R124  4.7K  [R 0402_L]
R125  4.7K  [R 0402_L]
SW3  SKRKAEE020  [SKRKAEE020]
SW4  SKRKAEE020  [SKRKAEE020]

### Nets
3V3: JP2.39 JP2.40 R120.2 R121.2
5V: JP2.1
GND: JP2.2 JP2.37 JP2.38 LED4.2(K) LED5.2(K) LED6.2(K) LED7.2(K) SW3.2 SW4.2
FPGA_GPIO34_8_N: JP2.13
FPGA_GPIO34_8_P: JP2.14
FPGA_GPIO34_9_N: JP2.11
FPGA_GPIO34_9_P: JP2.12
FPGA_GPIO34_10_N: JP2.15
FPGA_GPIO34_10_P: JP2.16
FPGA_GPIO34_11_N: JP2.9
FPGA_GPIO34_11_P: JP2.10
FPGA_GPIO34_12_N: JP2.19
FPGA_GPIO34_12_P: JP2.20
FPGA_GPIO34_13_N: JP2.34
FPGA_GPIO34_13_P: JP2.36
FPGA_GPIO34_14_N: JP2.33
FPGA_GPIO34_14_P: JP2.35
FPGA_GPIO34_15_N: JP2.30
FPGA_GPIO34_15_P: JP2.32
FPGA_GPIO34_16_N: JP2.28
FPGA_GPIO34_16_P: JP2.27
FPGA_GPIO34_17_N: JP2.26
FPGA_GPIO34_17_P: JP2.24
FPGA_GPIO34_18_N: JP2.17
FPGA_GPIO34_18_P: JP2.18
FPGA_GPIO34_19_N: JP2.5
FPGA_GPIO34_19_P: JP2.6
FPGA_GPIO34_20_N: JP2.7
FPGA_GPIO34_20_P: JP2.8
FPGA_GPIO34_21_N: JP2.21
FPGA_GPIO34_21_P: JP2.22
FPGA_GPIO34_22_N: JP2.25
FPGA_GPIO34_22_P: JP2.23
FPGA_GPIO34_23_N: JP2.31
FPGA_GPIO34_23_P: JP2.29
FPGA_GPIO34_24_N: JP2.3
FPGA_GPIO34_24_P: JP2.4
FPGA_PL_KEY: R121.1 SW3.1
FPGA_PL_LED1: R125.2
FPGA_PL_LED2: R124.2
FPGA_PL_LED3: R123.2
FPGA_PL_LED4: R122.2
FPGA_PS_KEY: R120.1 SW4.1
NetLED4_1: LED4.1(A) R122.1
NetLED5_1: LED5.1(A) R123.1
NetLED6_1: LED6.1(A) R124.1
NetLED7_1: LED7.1(A) R125.1

### Library data of the parts
JP2 = Header 20X2: 20*2P接插件; 版权归属: 源创客; BOM名称: 20*2P接插件; 学习资源: www.ooocke.com
LED4-LED7 = LED-SMD: 贴片LED; 版权归属: 源创客; BOM名称: 贴片LED; 学习资源: www.ooocke.com
R120-R125 = R: 贴片电阻; 版权归属: 源创客; BOM名称: 贴片电阻; 学习资源: www.ooocke.com
SW3 SW4 = SKRKAEE020: as SW2 on sheet BANK500_501

## Sheet POWER.SchDoc: POWER
size A4; DrawnBy: nand; DocumentNumber: 1; Revision: V0.1; SheetNumber: 2; SheetTotal: 13
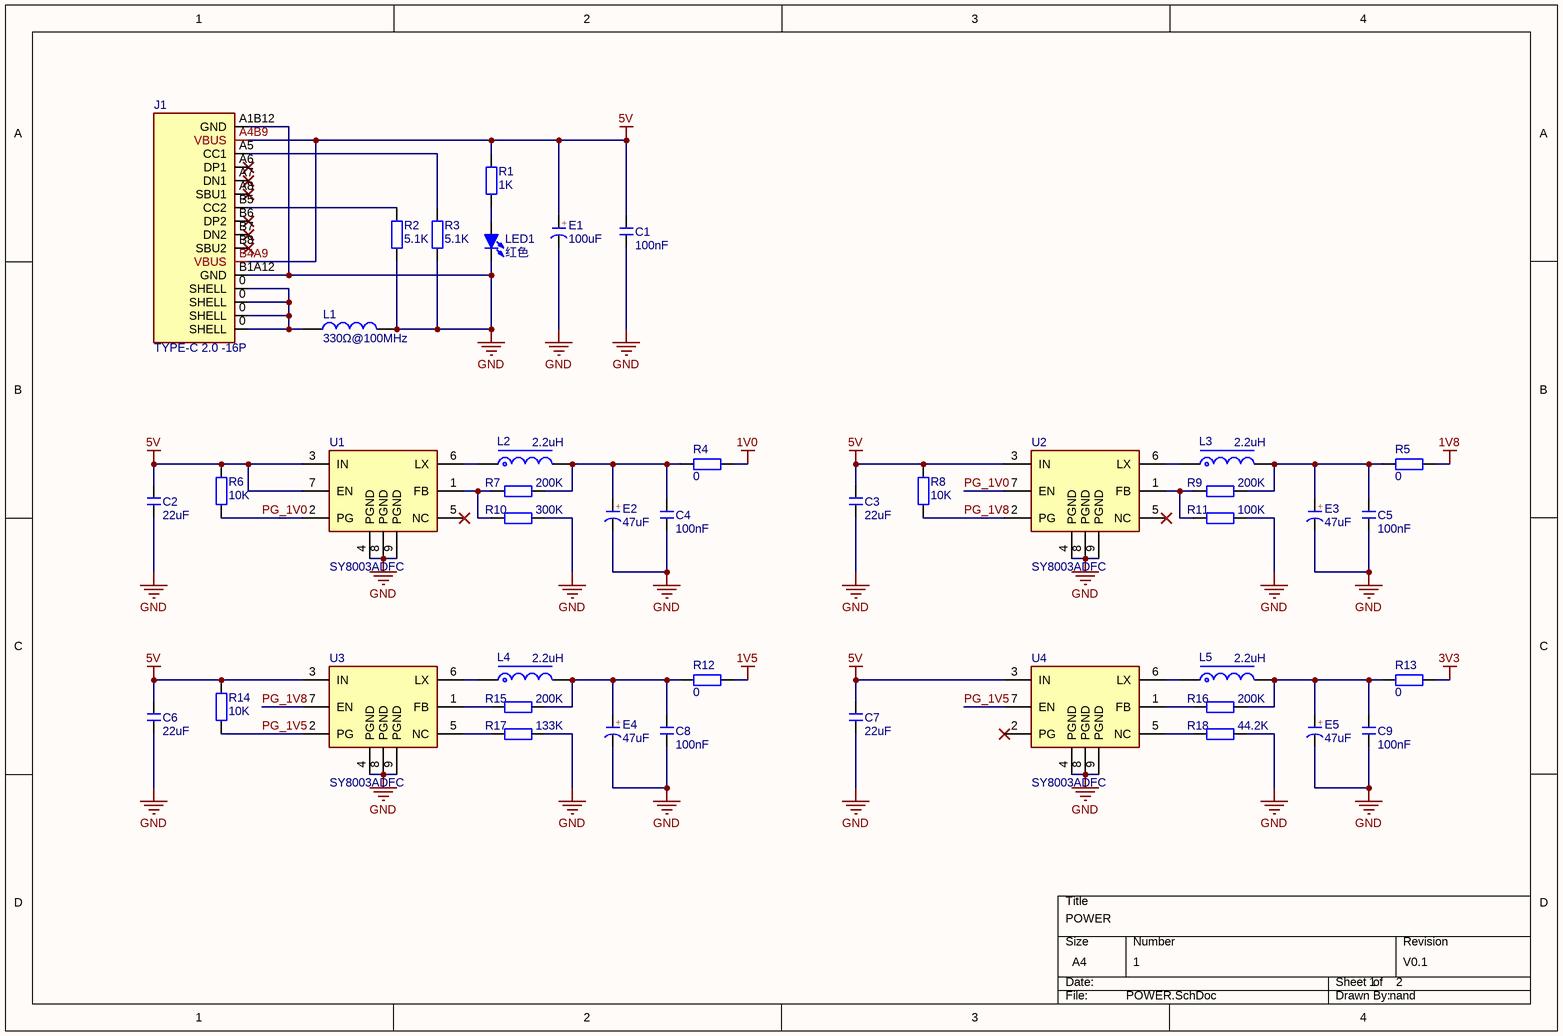
[diagram p10: POWER.SchDoc]

### Parts
C1  100nF  [C 0402_L]
C2  22uF  [C 0805_L]
C3  22uF  [C 0805_L]
C4  100nF  [C 0402_L]
C5  100nF  [C 0402_L]
C6  22uF  [C 0805_L]
C7  22uF  [C 0805_L]
C8  100nF  [C 0402_L]
C9  100nF  [C 0402_L]
E1  100uF  [CD A(3216)]
E2  47uF  [CD A(3216)]
E3  47uF  [CD A(3216)]
E4  47uF  [CD A(3216)]
E5  47uF  [CD A(3216)]
J1  TYPE-C 2.0 -16P  [USB-C-SMD_16P]
L1  330Ω@100MHz  [L 0805]
L2  2.2uH  [CD52]
L3  2.2uH  [CD52]
L4  2.2uH  [CD52]
L5  2.2uH  [CD52]
LED1  红色  [LED 0805G]
R1  1K  [R 0402_L]
R2  5.1K  [R 0402_L]
R3  5.1K  [R 0402_L]
R4  0  [R 0603_L]
R5  0  [R 0603_L]
R6  10K  [R 0402_L]
R7  200K  [R 0805_L]
R8  10K  [R 0402_L]
R9  200K  [R 0805_L]
R10  300K  [R 0805_L]
R11  100K  [R 0805_L]
R12  0  [R 0603_L]
R13  0  [R 0603_L]
R14  10K  [R 0402_L]
R15  200K  [R 0805_L]
R16  200K  [R 0805_L]
R17  133K  [R 0805_L]
R18  44.2K  [R 0805_L]
U1  SY8003ADFC  [SON50P200X200X65-9N]
U2  SY8003ADFC  [SON50P200X200X65-9N]
U3  SY8003ADFC  [SON50P200X200X65-9N]
U4  SY8003ADFC  [SON50P200X200X65-9N]

### Nets
1V0: R4.1
1V5: R12.1
1V8: R5.1
3V3: R13.1
5V: C1.2 C2.2 C3.2 C6.2 C7.2 E1.1(A) J1.A4B9(VBUS) J1.B4A9(VBUS) R1.2 R6.2 R8.2 R14.2 U1.3(IN) U1.7(EN) U2.3(IN) U3.3(IN) U4.3(IN)
GND: C1.1 C2.1 C3.1 C4.1 C5.1 C6.1 C7.1 C8.1 C9.1 E1.2(K) E2.2(K) E3.2(K) E4.2(K) E5.2(K) J1.A1B12(GND) J1.B1A12(GND) L1.2 LED1.2(K) R2.1 R3.1 R10.1 R11.1 R17.1 R18.1 U1.4(PGND) U1.8(PGND) U1.9(PGND) U2.4(PGND) U2.8(PGND) U2.9(PGND) U3.4(PGND) U3.8(PGND) U3.9(PGND) U4.4(PGND) U4.8(PGND) U4.9(PGND)
PG_1V0: R6.1 U1.2(PG) U2.7(EN)
PG_1V5: R14.1 U3.2(PG) U4.7(EN)
PG_1V8: R8.1 U2.2(PG) U3.7(EN)
NetC4_2: C4.2 E2.1(A) L2.2 R4.2 R7.1
NetC5_2: C5.2 E3.1(A) L3.2 R5.2 R9.1
NetC8_2: C8.2 E4.1(A) L4.2 R12.2 R15.1
NetC9_2: C9.2 E5.1(A) L5.2 R13.2 R16.1
NetJ1_0: J1.0(SHELL) L1.1
NetJ1_A5: J1.A5(CC1) R3.2
NetJ1_B5: J1.B5(CC2) R2.2
NetL2_1: L2.1 U1.6(LX)
NetL3_1: L3.1 U2.6(LX)
NetL4_1: L4.1 U3.6(LX)
NetL5_1: L5.1 U4.6(LX)
NetLED1_1: LED1.1(A) R1.1
NetR7_2: R7.2 R10.2 U1.1(FB)
NetR9_2: R9.2 R11.2 U2.1(FB)
NetR15_2: R15.2 U3.1(FB)
NetR16_2: R16.2 U4.1(FB)
NetR17_2: R17.2 U3.5(NC)
NetR18_2: R18.2 U4.5(NC)

Not connected (* = marked no-connect by the designer): J1 A6(DP1)* A7(DN1)* A8(SBU1)* B6(DP2)* B7(DN2)* B8(SBU2)*; U1 5(NC)*; U2 5(NC)*; U4 2(PG)*

### Notes on the sheet
- (in symbol C-CD) +

### Library data of the parts
C1-C9 = C: 无极性贴片电容; 版权归属: 源创客; BOM名称: 无极性贴片电容; 学习资源: www.ooocke.com
E1-E5 = C-CD: 贴片钽电容; 版权归属: 源创客; BOM名称: 贴片钽电容; 学习资源: www.ooocke.com
J1 = USB2.0_Type-C_16Pin: as USBC1 on sheet FLASH
L1 = L: 小功率贴片电感; 版权归属: 源创客; BOM名称: 小功率贴片电感; 学习资源: www.ooocke.com
L2-L5 = L-CD: 贴片功率电感; BOM名称: 功率电感; 版权归属: 源创客; 学习资源: www.ooocke.com
LED1 = LED-SMD: 贴片LED; 版权归属: 源创客; BOM名称: 贴片LED; 学习资源: www.ooocke.com
R1-R18 = R: 贴片电阻; 版权归属: 源创客; BOM名称: 贴片电阻; 学习资源: www.ooocke.com
U1-U4 = SY8003ADFC: 开关电源; Manufacturer_Name: Silergy; Datasheet Link: https://datasheet.lcsc.com/lcsc/1808011444_Silergy-Corp-SY8003ADFC_C178236.pdf; Height: 0.65mm; Manufacturer_Part_Number: SY8003ADFC

## Sheet USB.SchDoc
size A4; SheetNumber: 12; SheetTotal: 13
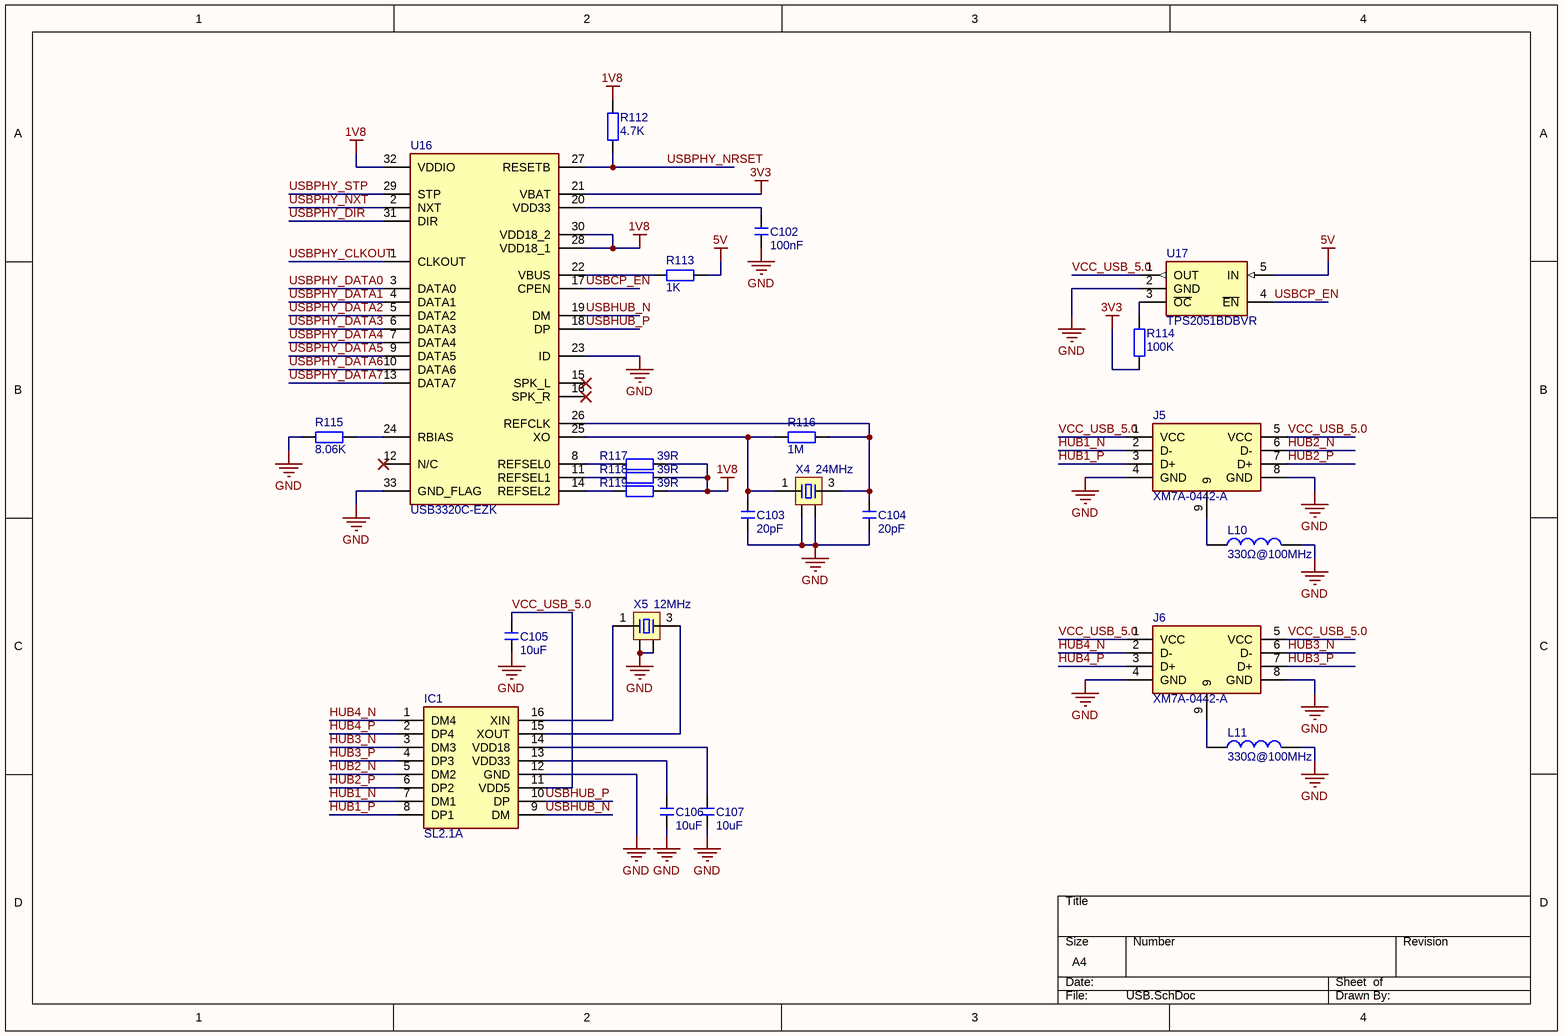
[diagram p11: USB.SchDoc]

### Parts
C102  100nF  [C 0402_L]
C103  20pF  [C 0805_L]
C104  20pF  [C 0805_L]
C105  10uF  [C 0603_L]
C106  10uF  [C 0603_L]
C107  10uF  [C 0603_L]
IC1  SL2.1A  [SOP16N_L]
J5  XM7A-0442-A  [XM7A0442A]
J6  XM7A-0442-A  [XM7A0442A]
L10  330Ω@100MHz  [L 0805]
L11  330Ω@100MHz  [L 0805]
R112  4.7K  [R 0402_L]
R113  1K  [R 0402_L]
R114  100K  [R 0805_L]
R115  8.06K  [R 0402_L]
R116  1M  [R 0402_L]
R117  39R  [R 0805_L]
R118  39R  [R 0805_L]
R119  39R  [R 0805_L]
U16  USB3320C-EZK  [QFN32 5x5_M]
U17  TPS2051BDBVR  [SOT23-5N]
X4  24MHz  [OSC 1612-4P]
X5  12MHz  [OSC 1612-4P]

### Nets
1V8: R112.2 R117.1 R118.1 R119.1 U16.28(VDD18_1) U16.30(VDD18_2) U16.32(VDDIO)
3V3: R114.1 U16.21(VBAT)
5V: R113.1 U17.5(IN)
GND: C102.1 C103.1 C104.1 C105.1 C106.1 C107.1 IC1.12(GND) J5.4(GND) J5.8(GND) J6.4(GND) J6.8(GND) L10.2 L11.2 R115.1 U16.23(ID) U16.33(GND_FLAG) U17.2(GND) X4.2 X4.4 X5.2 X5.4
HUB1_N: IC1.7(DM1) J5.2(D-)
HUB1_P: IC1.8(DP1) J5.3(D+)
HUB2_N: IC1.5(DM2) J5.6(D-)
HUB2_P: IC1.6(DP2) J5.7(D+)
HUB3_N: IC1.3(DM3) J6.6(D-)
HUB3_P: IC1.4(DP3) J6.7(D+)
HUB4_N: IC1.1(DM4) J6.2(D-)
HUB4_P: IC1.2(DP4) J6.3(D+)
USBCP_EN: U16.17(CPEN) U17.4(~{EN})
USBHUB_N: IC1.9(DM) U16.19(DM)
USBHUB_P: IC1.10(DP) U16.18(DP)
USBPHY_CLKOUT: U16.1(CLKOUT)
USBPHY_DATA0: U16.3(DATA0)
USBPHY_DATA1: U16.4(DATA1)
USBPHY_DATA2: U16.5(DATA2)
USBPHY_DATA3: U16.6(DATA3)
USBPHY_DATA4: U16.7(DATA4)
USBPHY_DATA5: U16.9(DATA5)
USBPHY_DATA6: U16.10(DATA6)
USBPHY_DATA7: U16.13(DATA7)
USBPHY_DIR: U16.31(DIR)
USBPHY_NRSET: R112.1 U16.27(RESETB)
USBPHY_NXT: U16.2(NXT)
USBPHY_STP: U16.29(STP)
VCC_USB_5.0: C105.2 IC1.11(VDD5) J5.1(VCC) J5.5(VCC) J6.1(VCC) J6.5(VCC) U17.1(OUT)
NetC102_2: C102.2 U16.20(VDD33)
NetC103_2: C103.2 R116.1 U16.25(XO) X4.1
NetC104_2: C104.2 R116.2 U16.26(REFCLK) X4.3
NetC106_2: C106.2 IC1.13(VDD33)
NetC107_2: C107.2 IC1.14(VDD18)
NetIC1_15: IC1.15(XOUT) X5.3
NetIC1_16: IC1.16(XIN) X5.1
NetJ5_9: J5.9 L10.1
NetJ6_9: J6.9 L11.1
NetR113_2: R113.2 U16.22(VBUS)
NetR114_2: R114.2 U17.3(~{OC})
NetR115_2: R115.2 U16.24(RBIAS)
NetR117_2: R117.2 U16.8(REFSEL0)
NetR118_2: R118.2 U16.11(REFSEL1)
NetR119_2: R119.2 U16.14(REFSEL2)

Not connected (* = marked no-connect by the designer): U16 12(N/C)* 15(SPK_L)* 16(SPK_R)*

### Library data of the parts
C102-C107 = C: 无极性贴片电容; 版权归属: 源创客; BOM名称: 无极性贴片电容; 学习资源: www.ooocke.com
IC1 = SL2.1A: Integrated Circuit; Manufacturer_Name: CoreChips ShenZhen CO.,Ltd; Datasheet Link: https://datasheet.lcsc.com/szlcsc/1811151645_CoreChips-SL2-1A_C192893.pdf; Height: 1.85mm; Manufacturer_Part_Number: SL2.1A
J5 J6 = XM7A-0442-A: USB2.0-A双层; Manufacturer_Name: Omron Electronics; Datasheet Link: https://www.arrow.com/en/products/xm7a-0442-a/omron; Height: 15.62mm; Manufacturer_Part_Number: XM7A-0442-A; Mouser Part Number: 653-XM7A-0442A; Mouser Price/Stock: https://www.mouser.co.uk/ProductDetail/Omron-Electronics/XM7A-0442-A?qs=RJLCOMRfwh3EnMRCxNWGgg%3D%3D; Arrow Part Number: XM7A-0442-A; Arrow Price/Stock: https://www.arrow.com/en/products/xm7a-0442-a/omron
L10 L11 = L: 小功率贴片电感; 版权归属: 源创客; BOM名称: 小功率贴片电感; 学习资源: www.ooocke.com
R112-R119 = R: 贴片电阻; 版权归属: 源创客; BOM名称: 贴片电阻; 学习资源: www.ooocke.com
U16 = USB3320C-EZK: USB集线芯片; Manufacturer_Name: Microchip; Datasheet Link: https://componentsearchengine.com/Datasheets/2/USB3320C-EZK.pdf; Height: 1mm; Manufacturer_Part_Number: USB3320C-EZK; Mouser Part Number: 886-USB3320C-EZK; Mouser Price/Stock: https://www.mouser.co.uk/ProductDetail/Microchip-Technology-Atmel/USB3320C-EZK?qs=pA5MXup5wxEV58aAJyVneA%3D%3D; Arrow Part Number: USB3320C-EZK; Arrow Price/Stock: https://www.arrow.com/en/products/usb3320c-ezk/microchip-technology?region=nac
U17 = TPS2051BDBVR: as U15 on sheet HDMI; Datasheet Link: http://www.ti.com/lit/ds/symlink/tps2051b.pdf; Height: 1.45mm; Manufacturer_Part_Number: TPS2051BDBVR; Mouser Part Number: 595-TPS2051BDBVR; Mouser Price/Stock: https://www.mouser.co.uk/ProductDetail/Texas-Instruments/TPS2051BDBVR?qs=7kv20MEVUljVx%2Fqc0C%252Bidw%3D%3D; Arrow Part Number: TPS2051BDBVR; Arrow Price/Stock: https://www.arrow.com/en/products/tps2051bdbvr/texas-instruments?region=nac
X4 X5 = XTAL-4P: 4脚无源晶振; 版权归属: 源创客; BOM名称: 4脚无源晶振; 学习资源: www.ooocke.com

## Sheet ZYNQ_POWER.SchDoc
size A4; SheetNumber: 7; SheetTotal: 13
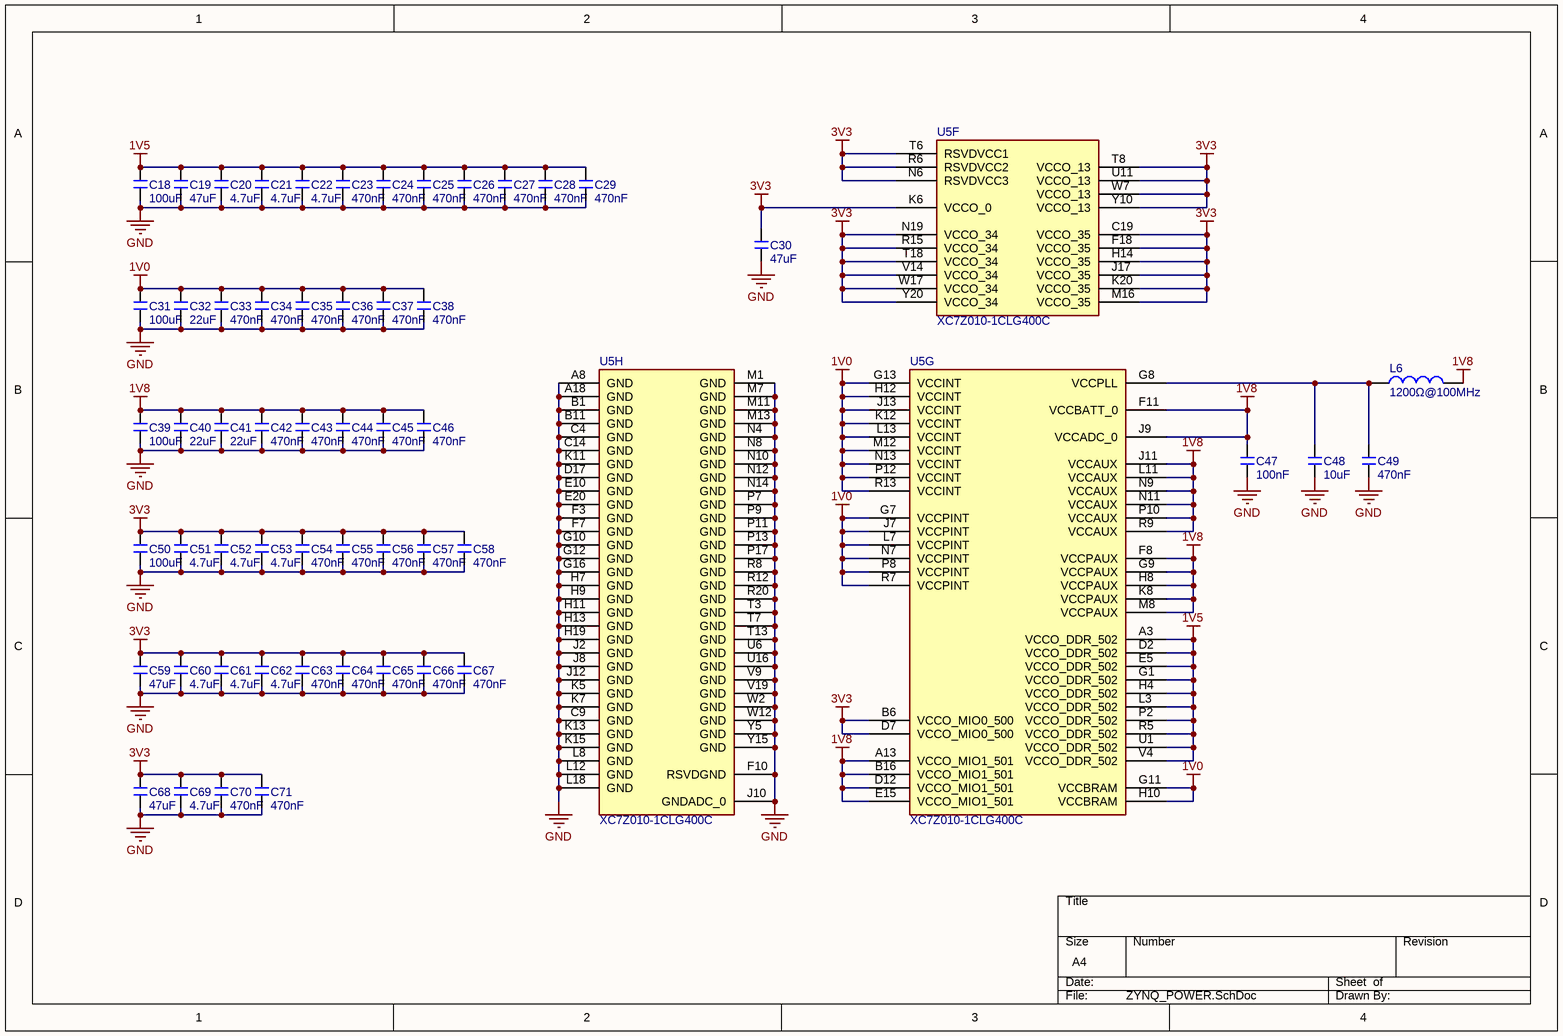
[diagram p12: ZYNQ_POWER.SchDoc]

### Parts
C18  100uF  [C 0805_L]
C19  47uF  [C 0805_L]
C20  4.7uF  [C 0603_L]
C21  4.7uF  [C 0603_L]
C22  4.7uF  [C 0603_L]
C23  470nF  [C 0805_L]
C24  470nF  [C 0805_L]
C25  470nF  [C 0805_L]
C26  470nF  [C 0805_L]
C27  470nF  [C 0805_L]
C28  470nF  [C 0805_L]
C29  470nF  [C 0805_L]
C30  47uF  [C 0805_L]
C31  100uF  [C 0805_L]
C32  22uF  [C 0805_L]
C33  470nF  [C 0805_L]
C34  470nF  [C 0805_L]
C35  470nF  [C 0805_L]
C36  470nF  [C 0805_L]
C37  470nF  [C 0805_L]
C38  470nF  [C 0805_L]
C39  100uF  [C 0805_L]
C40  22uF  [C 0805_L]
C41  22uF  [C 0805_L]
C42  470nF  [C 0805_L]
C43  470nF  [C 0805_L]
C44  470nF  [C 0805_L]
C45  470nF  [C 0805_L]
C46  470nF  [C 0805_L]
C47  100nF  [C 0402_L]
C48  10uF  [C 0603_L]
C49  470nF  [C 0805_L]
C50  100uF  [C 0805_L]
C51  4.7uF  [C 0603_L]
C52  4.7uF  [C 0603_L]
C53  4.7uF  [C 0603_L]
C54  470nF  [C 0805_L]
C55  470nF  [C 0805_L]
C56  470nF  [C 0805_L]
C57  470nF  [C 0805_L]
C58  470nF  [C 0805_L]
C59  47uF  [C 0805_L]
C60  4.7uF  [C 0603_L]
C61  4.7uF  [C 0603_L]
C62  4.7uF  [C 0603_L]
C63  470nF  [C 0805_L]
C64  470nF  [C 0805_L]
C65  470nF  [C 0805_L]
C66  470nF  [C 0805_L]
C67  470nF  [C 0805_L]
C68  47uF  [C 0805_L]
C69  4.7uF  [C 0603_L]
C70  470nF  [C 0805_L]
C71  470nF  [C 0805_L]
L6  1200Ω@100MHz  [L 0805]
U5  XC7Z010-1CLG400C  [CLG400]  (parts F,G,H of 9)

### Nets
1V0: C31.1 C32.2 C33.2 C34.2 C35.2 C36.2 C37.2 C38.2 U5.G7(VCCPINT) U5.G11(VCCBRAM) U5.G13(VCCINT) U5.H10(VCCBRAM) U5.H12(VCCINT) U5.J7(VCCPINT) U5.J13(VCCINT) U5.K12(VCCINT) U5.L7(VCCPINT) U5.L13(VCCINT) U5.M12(VCCINT) U5.N7(VCCPINT) U5.N13(VCCINT) U5.P8(VCCPINT) U5.P12(VCCINT) U5.R7(VCCPINT) U5.R13(VCCINT)
1V5: C18.1 C19.2 C20.2 C21.2 C22.2 C23.2 C24.2 C25.2 C26.2 C27.2 C28.2 C29.2 U5.A3(VCCO_DDR_502) U5.D2(VCCO_DDR_502) U5.E5(VCCO_DDR_502) U5.G1(VCCO_DDR_502) U5.H4(VCCO_DDR_502) U5.L3(VCCO_DDR_502) U5.P2(VCCO_DDR_502) U5.R5(VCCO_DDR_502) U5.U1(VCCO_DDR_502) U5.V4(VCCO_DDR_502)
1V8: C39.1 C40.2 C41.2 C42.2 C43.2 C44.2 C45.2 C46.2 C47.2 L6.2 U5.A13(VCCO_MIO1_501) U5.B16(VCCO_MIO1_501) U5.D12(VCCO_MIO1_501) U5.E15(VCCO_MIO1_501) U5.F8(VCCPAUX) U5.F11(VCCBATT_0) U5.G9(VCCPAUX) U5.H8(VCCPAUX) U5.J9(VCCADC_0) U5.J11(VCCAUX) U5.K8(VCCPAUX) U5.L11(VCCAUX) U5.M8(VCCPAUX) U5.N9(VCCAUX) U5.N11(VCCAUX) U5.P10(VCCAUX) U5.R9(VCCAUX)
3V3: C30.2 C50.1 C51.2 C52.2 C53.2 C54.2 C55.2 C56.2 C57.2 C58.2 C59.1 C60.2 C61.2 C62.2 C63.2 C64.2 C65.2 C66.2 C67.2 C68.1 C69.2 C70.2 C71.2 U5.B6(VCCO_MIO0_500) U5.C19(VCCO_35) U5.D7(VCCO_MIO0_500) U5.F18(VCCO_35) U5.H14(VCCO_35) U5.J17(VCCO_35) U5.K6(VCCO_0) U5.K20(VCCO_35) U5.M16(VCCO_35) U5.N6(RSVDVCC3) U5.N19(VCCO_34) U5.R6(RSVDVCC2) U5.R15(VCCO_34) U5.T6(RSVDVCC1) U5.T8(VCCO_13) U5.T18(VCCO_34) U5.U11(VCCO_13) U5.V14(VCCO_34) U5.W7(VCCO_13) U5.W17(VCCO_34) U5.Y10(VCCO_13) U5.Y20(VCCO_34)
GND: C18.2 C19.1 C20.1 C21.1 C22.1 C23.1 C24.1 C25.1 C26.1 C27.1 C28.1 C29.1 C30.1 C31.2 C32.1 C33.1 C34.1 C35.1 C36.1 C37.1 C38.1 C39.2 C40.1 C41.1 C42.1 C43.1 C44.1 C45.1 C46.1 C47.1 C48.1 C49.1 C50.2 C51.1 C52.1 C53.1 C54.1 C55.1 C56.1 C57.1 C58.1 C59.2 C60.1 C61.1 C62.1 C63.1 C64.1 C65.1 C66.1 C67.1 C68.2 C69.1 C70.1 C71.1 U5.A8(GND) U5.A18(GND) U5.B1(GND) U5.B11(GND) U5.C4(GND) U5.C9(GND) U5.C14(GND) U5.D17(GND) U5.E10(GND) U5.E20(GND) U5.F3(GND) U5.F7(GND) U5.F10(RSVDGND) U5.G10(GND) U5.G12(GND) U5.G16(GND) U5.H7(GND) U5.H9(GND) U5.H11(GND) U5.H13(GND) U5.H19(GND) U5.J2(GND) U5.J8(GND) U5.J10(GNDADC_0) U5.J12(GND) U5.K5(GND) U5.K7(GND) U5.K11(GND) U5.K13(GND) U5.K15(GND) U5.L8(GND) U5.L12(GND) U5.L18(GND) U5.M1(GND) U5.M7(GND) U5.M11(GND) U5.M13(GND) U5.N4(GND) U5.N8(GND) U5.N10(GND) U5.N12(GND) U5.N14(GND) U5.P7(GND) U5.P9(GND) U5.P11(GND) U5.P13(GND) U5.P17(GND) U5.R8(GND) U5.R12(GND) U5.R20(GND) U5.T3(GND) U5.T7(GND) U5.T13(GND) U5.U6(GND) U5.U16(GND) U5.V9(GND) U5.V19(GND) U5.W2(GND) U5.W12(GND) U5.Y5(GND) U5.Y15(GND)
NetC48_2: C48.2 C49.2 L6.1 U5.G8(VCCPLL)

### Library data of the parts
C18-C71 = C: 无极性贴片电容; 版权归属: 源创客; BOM名称: 无极性贴片电容; 学习资源: www.ooocke.com
L6 = L: 小功率贴片电感; 版权归属: 源创客; BOM名称: 小功率贴片电感; 学习资源: www.ooocke.com
U5 = XC7Z010-1CLG400C: ZYNQ7000芯片

## Nets that join several sheets
1V0: ETH (10 pins), POWER (R4.1), ZYNQ_POWER (25 pins)
1V5: BANK502 (C14.2 R42.2 R43.1), DDR3 (24 pins), POWER (R12.1), ZYNQ_POWER (22 pins)
1V8: BANK500_501 (R28.1), ETH (13 pins), FLASH (U11.6 U12.5), POWER (R5.1), USB (7 pins), ZYNQ_POWER (27 pins)
3V3: BANK0 (5 pins), BANK34_35 (C10.2 X1.1 X1.4), BANK500_501 (6 pins), ETH (9 pins), FLASH (20 pins), HDMI (10 pins), IO_LED (JP2.39 JP2.40 R120.2 R121.2), POWER (R13.1), USB (R114.1 U16.21), ZYNQ_POWER (45 pins)
5V: FLASH (5 pins), HDMI (U15.5), IO_LED (JP2.1), POWER (17 pins), USB (R113.1 U17.5)
GND: BANK0 (7 pins), BANK34_35 (C10.1 R23.2 X1.2), BANK500_501 (14 pins), BANK502 (5 pins), DDR3 (12 pins), ETH (28 pins), FLASH (24 pins), HDMI (8 pins), IO_LED (9 pins), POWER (36 pins), USB (21 pins), ZYNQ_POWER (115 pins)
DDR3_A0: BANK502 (U5.N2), DDR3 (R62.1 U7.N3)
DDR3_A1: BANK502 (U5.K2), DDR3 (R55.1 U7.P7)
DDR3_A2: BANK502 (U5.M3), DDR3 (R66.1 U7.P3)
DDR3_A3: BANK502 (U5.K3), DDR3 (R68.1 U7.N2)
DDR3_A4: BANK502 (U5.M4), DDR3 (R49.1 U7.P8)
DDR3_A5: BANK502 (U5.L1), DDR3 (R67.1 U7.P2)
DDR3_A6: BANK502 (U5.L4), DDR3 (R51.1 U7.R8)
DDR3_A7: BANK502 (U5.K4), DDR3 (R65.1 U7.R2)
DDR3_A8: BANK502 (U5.K1), DDR3 (R52.1 U7.T8)
DDR3_A9: BANK502 (U5.J4), DDR3 (R64.1 U7.R3)
DDR3_A10: BANK502 (U5.F5), DDR3 (R57.1 U7.L7)
DDR3_A11: BANK502 (U5.G4), DDR3 (R53.1 U7.R7)
DDR3_A12: BANK502 (U5.E4), DDR3 (R56.1 U7.N7)
DDR3_A13: BANK502 (U5.D4), DDR3 (R63.1 U7.T3)
DDR3_A14: BANK502 (U5.F4), DDR3 (R54.1 U7.T7)
DDR3_BA0: BANK502 (U5.L5), DDR3 (R69.1 U7.M2)
DDR3_BA1: BANK502 (U5.R4), DDR3 (R48.1 U7.N8)
DDR3_BA2: BANK502 (U5.J5), DDR3 (R61.1 U7.M3)
DDR3_CAS: BANK502 (U5.P5), DDR3 (R59.1 U7.K3)
DDR3_CKE: BANK502 (U5.N3), DDR3 (R47.1 U7.K9)
DDR3_CLK0_N: BANK502 (U5.M2), DDR3 (R72.2 U7.K7)
DDR3_CLK0_P: BANK502 (U5.L2), DDR3 (R72.1 U7.J7)
DDR3_D0: BANK502 (U5.D3), DDR3 (U7.E3)
DDR3_D1: BANK502 (U5.A2), DDR3 (U7.F7)
DDR3_D2: BANK502 (U5.A4), DDR3 (U7.F2)
DDR3_D3: BANK502 (U5.C3), DDR3 (U7.F8)
DDR3_D4: BANK502 (U5.C1), DDR3 (U7.H3)
DDR3_D5: BANK502 (U5.E1), DDR3 (U7.H8)
DDR3_D6: BANK502 (U5.B3), DDR3 (U7.G2)
DDR3_D7: BANK502 (U5.D1), DDR3 (U7.H7)
DDR3_D8: BANK502 (U5.H1), DDR3 (U7.D7)
DDR3_D9: BANK502 (U5.H3), DDR3 (U7.C3)
DDR3_D10: BANK502 (U5.J3), DDR3 (U7.C8)
DDR3_D11: BANK502 (U5.G3), DDR3 (U7.C2)
DDR3_D12: BANK502 (U5.H2), DDR3 (U7.A7)
DDR3_D13: BANK502 (U5.E3), DDR3 (U7.A2)
DDR3_D14: BANK502 (U5.J1), DDR3 (U7.B8)
DDR3_D15: BANK502 (U5.E2), DDR3 (U7.A3)
DDR3_DM0: BANK502 (U5.A1), DDR3 (U7.E7)
DDR3_DM1: BANK502 (U5.F1), DDR3 (U7.D3)
DDR3_DQS0_N: BANK502 (U5.B2), DDR3 (U7.G3)
DDR3_DQS0_P: BANK502 (U5.C2), DDR3 (U7.F3)
DDR3_DQS1_N: BANK502 (U5.F2), DDR3 (U7.B7)
DDR3_DQS1_P: BANK502 (U5.G2), DDR3 (U7.C7)
DDR3_ODT: BANK502 (U5.N5), DDR3 (R71.1 U7.K1)
DDR3_RAS: BANK502 (U5.P4), DDR3 (R58.1 U7.J3)
DDR3_RESET: BANK502 (U5.B4), DDR3 (R75.1 U7.T2)
DDR3_S0: BANK502 (U5.N1), DDR3 (R70.1 U7.L2)
DDR3_WE: BANK502 (U5.M5), DDR3 (R60.1 U7.L3)
FPGA_GPIO34_8_N: BANK34_35 (U5.Y14), IO_LED (JP2.13)
FPGA_GPIO34_8_P: BANK34_35 (U5.W14), IO_LED (JP2.14)
FPGA_GPIO34_9_N: BANK34_35 (U5.U17), IO_LED (JP2.11)
FPGA_GPIO34_9_P: BANK34_35 (U5.T16), IO_LED (JP2.12)
FPGA_GPIO34_10_N: BANK34_35 (U5.W15), IO_LED (JP2.15)
FPGA_GPIO34_10_P: BANK34_35 (U5.V15), IO_LED (JP2.16)
FPGA_GPIO34_11_N: BANK34_35 (U5.U15), IO_LED (JP2.9)
FPGA_GPIO34_11_P: BANK34_35 (U5.U14), IO_LED (JP2.10)
FPGA_GPIO34_12_N: BANK34_35 (U5.U19), IO_LED (JP2.19)
FPGA_GPIO34_12_P: BANK34_35 (U5.U18), IO_LED (JP2.20)
FPGA_GPIO34_13_N: BANK34_35 (U5.P19), IO_LED (JP2.34)
FPGA_GPIO34_13_P: BANK34_35 (U5.N18), IO_LED (JP2.36)
FPGA_GPIO34_14_N: BANK34_35 (U5.P20), IO_LED (JP2.33)
FPGA_GPIO34_14_P: BANK34_35 (U5.N20), IO_LED (JP2.35)
FPGA_GPIO34_15_N: BANK34_35 (U5.U20), IO_LED (JP2.30)
FPGA_GPIO34_15_P: BANK34_35 (U5.T20), IO_LED (JP2.32)
FPGA_GPIO34_16_N: BANK34_35 (U5.W20), IO_LED (JP2.28)
FPGA_GPIO34_16_P: BANK34_35 (U5.V20), IO_LED (JP2.27)
FPGA_GPIO34_17_N: BANK34_35 (U5.Y19), IO_LED (JP2.26)
FPGA_GPIO34_17_P: BANK34_35 (U5.Y18), IO_LED (JP2.24)
FPGA_GPIO34_18_N: BANK34_35 (U5.W16), IO_LED (JP2.17)
FPGA_GPIO34_18_P: BANK34_35 (U5.V16), IO_LED (JP2.18)
FPGA_GPIO34_19_N: BANK34_35 (U5.R17), IO_LED (JP2.5)
FPGA_GPIO34_19_P: BANK34_35 (U5.R16), IO_LED (JP2.6)
FPGA_GPIO34_20_N: BANK34_35 (U5.R18), IO_LED (JP2.7)
FPGA_GPIO34_20_P: BANK34_35 (U5.T17), IO_LED (JP2.8)
FPGA_GPIO34_21_N: BANK34_35 (U5.V18), IO_LED (JP2.21)
FPGA_GPIO34_21_P: BANK34_35 (U5.V17), IO_LED (JP2.22)
FPGA_GPIO34_22_N: BANK34_35 (U5.W19), IO_LED (JP2.25)
FPGA_GPIO34_22_P: BANK34_35 (U5.W18), IO_LED (JP2.23)
FPGA_GPIO34_23_N: BANK34_35 (U5.P18), IO_LED (JP2.31)
FPGA_GPIO34_23_P: BANK34_35 (U5.N17), IO_LED (JP2.29)
FPGA_GPIO34_24_N: BANK34_35 (U5.P16), IO_LED (JP2.3)
FPGA_GPIO34_24_P: BANK34_35 (U5.P15), IO_LED (JP2.4)
FPGA_I2C_SCL2: BANK34_35 (U5.G18), FLASH (R78.2 U9.6)
FPGA_I2C_SDA2: BANK34_35 (U5.G17), FLASH (R79.2 U9.5)
FPGA_PL_KEY: BANK34_35 (U5.M19), IO_LED (R121.1 SW3.1)
FPGA_PL_LED1: BANK34_35 (U5.T12), IO_LED (R125.2)
FPGA_PL_LED2: BANK34_35 (U5.U12), IO_LED (R124.2)
FPGA_PL_LED3: BANK34_35 (U5.V12), IO_LED (R123.2)
FPGA_PL_LED4: BANK34_35 (U5.W13), IO_LED (R122.2)
FPGA_PS_KEY: BANK500_501 (U5.E6), IO_LED (R120.1 SW4.1)
HDMI_CLK_N: BANK34_35 (U5.H17), HDMI (J4.12 R111.1)
HDMI_CLK_P: BANK34_35 (U5.H16), HDMI (J4.10 R110.1)
HDMI_DATA0_N: BANK34_35 (U5.D20), HDMI (J4.9 R109.1)
HDMI_DATA0_P: BANK34_35 (U5.D19), HDMI (J4.7 R108.1)
HDMI_DATA1_N: BANK34_35 (U5.B20), HDMI (J4.6 R107.1)
HDMI_DATA1_P: BANK34_35 (U5.C20), HDMI (J4.4 R106.1)
HDMI_DATA2_N: BANK34_35 (U5.A20), HDMI (J4.3 R105.1)
HDMI_DATA2_P: BANK34_35 (U5.B19), HDMI (J4.1 R104.1)
HDMI_OUT_EN: BANK34_35 (U5.F17), HDMI (U15.4)
PHY_MDC: BANK500_501 (U5.C10), ETH (U14.30)
PHY_MDIO: BANK500_501 (U5.C11), ETH (R87.1 U14.31)
PHY_RX_CLK: BANK500_501 (U5.B17), ETH (R96.2 U14.19)
PHY_RXCTL: BANK500_501 (U5.D13), ETH (R94.2 U14.13)
PHY_RXD0: BANK500_501 (U5.D11), ETH (R89.1 U14.14)
PHY_RXD1: BANK500_501 (U5.A16), ETH (R90.1 U14.16)
PHY_RXD2: BANK500_501 (U5.F15), ETH (R91.1 U14.17)
PHY_RXD3: BANK500_501 (U5.A15), ETH (R92.1 U14.18)
PHY_TX_CLK: BANK500_501 (U5.A19), ETH (U14.22)
PHY_TXCTL: BANK500_501 (U5.F14), ETH (U14.27)
PHY_TXD0: BANK500_501 (U5.E14), ETH (U14.23)
PHY_TXD1: BANK500_501 (U5.B18), ETH (U14.24)
PHY_TXD2: BANK500_501 (U5.D10), ETH (U14.25)
PHY_TXD3: BANK500_501 (U5.A17), ETH (U14.26)
QSPI_CLK: BANK500_501 (R32.1 R34.1), FLASH (U8.6)
QSPI_CS: BANK500_501 (U5.A7), FLASH (R77.2 U8.1)
QSPI_DQ0: BANK500_501 (R27.1 U5.B8), FLASH (U8.5)
QSPI_DQ1: BANK500_501 (R30.1 U5.D6), FLASH (U8.2)
QSPI_DQ2: BANK500_501 (R37.1 U5.B7), FLASH (U8.3)
QSPI_DQ3: BANK500_501 (R38.1 U5.A6), FLASH (U8.7)
SD0_CMD: BANK500_501 (U5.C17), FLASH (U10.4)
SD0_D0: BANK500_501 (U5.E12), FLASH (U10.6)
SD0_D1: BANK500_501 (U5.A9), FLASH (U10.7)
SD0_D2: BANK500_501 (U5.F13), FLASH (U10.1)
SD0_D3: BANK500_501 (U5.B15), FLASH (U10.3)
SD0_SCK: BANK500_501 (R41.1), FLASH (U10.9)
USBPHY_CLKOUT: BANK500_501 (U5.A11), USB (U16.1)
USBPHY_DATA0: BANK500_501 (U5.A14), USB (U16.3)
USBPHY_DATA1: BANK500_501 (U5.D15), USB (U16.4)
USBPHY_DATA2: BANK500_501 (U5.A12), USB (U16.5)
USBPHY_DATA3: BANK500_501 (U5.F12), USB (U16.6)
USBPHY_DATA4: BANK500_501 (U5.C16), USB (U16.7)
USBPHY_DATA5: BANK500_501 (U5.A10), USB (U16.9)
USBPHY_DATA6: BANK500_501 (U5.E13), USB (U16.10)
USBPHY_DATA7: BANK500_501 (U5.C18), USB (U16.13)
USBPHY_DIR: BANK500_501 (U5.C13), USB (U16.31)
USBPHY_NRSET: BANK500_501 (U5.D16), USB (R112.1 U16.27)
USBPHY_NXT: BANK500_501 (U5.E16), USB (U16.2)
USBPHY_STP: BANK500_501 (U5.C15), USB (U16.29)
ZYNQ_UART1_RXD: BANK500_501 (U5.C12), FLASH (U11.4)
ZYNQ_UART1_TXD: BANK500_501 (U5.B12), FLASH (U12.3)